# EAGLE design IO V1.1 (EAGLE 9.6.2)

## Sheet 1 of 6: BUS
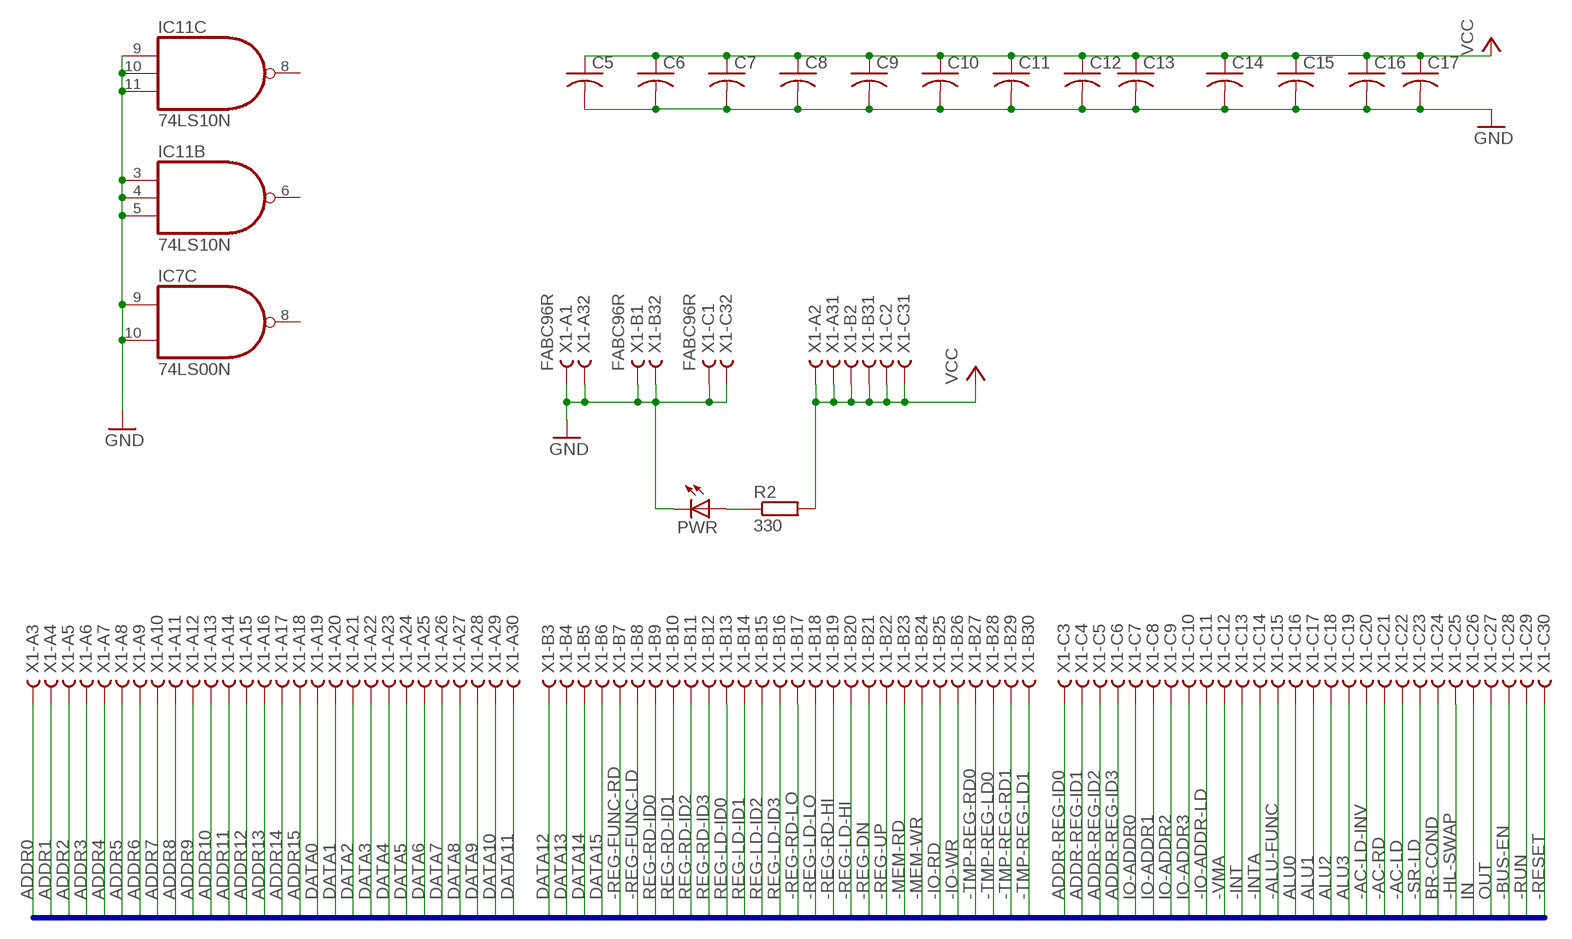
[diagram p0: schematic, sheet 1]

### Parts
C5  C-US025-024X044  [C025-024X044]
C6  C-US025-024X044  [C025-024X044]
C7  C-US025-024X044  [C025-024X044]
C8  C-US025-024X044  [C025-024X044]
C9  C-US025-024X044  [C025-024X044]
C10  C-US025-024X044  [C025-024X044]
C11  C-US025-024X044  [C025-024X044]
C12  C-US025-024X044  [C025-024X044]
C13  C-US025-024X044  [C025-024X044]
C14  C-US025-024X044  [C025-024X044]
C15  C-US025-024X044  [C025-024X044]
C16  C-US025-024X044  [C025-024X044]
C17  C-US025-024X044  [C025-024X044]
IC7  74LS00N  [DIL14]
IC11  74LS10N  [DIL14]
PWR  LED5MM  [LED5MM]
R2  330  R0207/10  [0207/10]
X1  FABC96R  [FABC96R]

### Nets
-AC-LD: X1.C22
-AC-LD-INV: X1.C20
-AC-RD: X1.C21
-ALU-FUNC: X1.C15
-BUS-EN: X1.C28
-HL-SWAP: X1.C25
-INT: X1.C13 ; also sheet 2
-INTA: X1.C14
-IO-ADDR-LD: X1.C11
-IO-RD: X1.B25 ; also sheet 6
-IO-WR: X1.B26 ; also sheet 6
-MEM-RD: X1.B23
-MEM-WR: X1.B24
-REG-DN: X1.B21
-REG-FUNC-LD: X1.B8
-REG-FUNC-RD: X1.B7
-REG-LD-HI: X1.B20
-REG-LD-LO: X1.B18
-REG-RD-HI: X1.B19
-REG-RD-LO: X1.B17
-REG-UP: X1.B22
-RESET: X1.C30 ; also sheet 6
-RUN: X1.C29
-SR-LD: X1.C23
-TMP-REG-LD0: X1.B28
-TMP-REG-LD1: X1.B30
-TMP-REG-RD0: X1.B27
-TMP-REG-RD1: X1.B29
-VMA: X1.C12
ADDR0: X1.A3
ADDR1: X1.A4
ADDR2: X1.A5
ADDR3: X1.A6
ADDR4: X1.A7
ADDR5: X1.A8
ADDR6: X1.A9
ADDR7: X1.A10
ADDR8: X1.A11
ADDR9: X1.A12
ADDR10: X1.A13
ADDR11: X1.A14
ADDR12: X1.A15
ADDR13: X1.A16
ADDR14: X1.A17
ADDR15: X1.A18
ADDR-REG-ID0: X1.C3
ADDR-REG-ID1: X1.C4
ADDR-REG-ID2: X1.C5
ADDR-REG-ID3: X1.C6
ALU0: X1.C16
ALU1: X1.C17
ALU2: X1.C18
ALU3: X1.C19
BR-COND: X1.C24
DATA0: X1.A19 ; also sheet 2,3,4,5
DATA1: X1.A20 ; also sheet 2,3,4,5
DATA2: X1.A21 ; also sheet 2,3,4,5
DATA3: X1.A22 ; also sheet 2,3,4,5
DATA4: X1.A23 ; also sheet 2,3,4,5
DATA5: X1.A24 ; also sheet 2,3,4,5
DATA6: X1.A25 ; also sheet 2,3,4,5
DATA7: X1.A26 ; also sheet 2,3,4,5
DATA8: X1.A27
DATA9: X1.A28
DATA10: X1.A29
DATA11: X1.A30
DATA12: X1.B3
DATA13: X1.B4
DATA14: X1.B5
DATA15: X1.B6
GND: C5.2 C6.2 C7.2 C8.2 C9.2 C10.2 C11.2 C12.2 C13.2 C14.2 C15.2 C16.2 C17.2 IC7.9(C:I0) IC7.10(C:I1) IC11.3(B:I0) IC11.4(B:I1) IC11.5(B:I2) IC11.9(C:I0) IC11.10(C:I1) IC11.11(C:I2) PWR.K(C) X1.A1 X1.A32 X1.B1 X1.B32 X1.C1 X1.C32 ; also sheet 2,3,4,5
IN: X1.C26 ; also sheet 4
IO-ADDR0: X1.C7 ; also sheet 5
IO-ADDR1: X1.C8 ; also sheet 5
IO-ADDR2: X1.C9 ; also sheet 5
IO-ADDR3: X1.C10 ; also sheet 5
N$11: PWR.A R2.1
OUT: X1.C27 ; also sheet 3
REG-LD-ID0: X1.B13
REG-LD-ID1: X1.B14
REG-LD-ID2: X1.B15
REG-LD-ID3: X1.B16
REG-RD-ID0: X1.B9
REG-RD-ID1: X1.B10
REG-RD-ID2: X1.B11
REG-RD-ID3: X1.B12
VCC: C5.1 C6.1 C7.1 C8.1 C9.1 C10.1 C11.1 C12.1 C13.1 C14.1 C15.1 C16.1 C17.1 R2.2 X1.A2 X1.A31 X1.B2 X1.B31 X1.C2 X1.C31 ; also sheet 2,3,4,5,6
Unconnected: IC7.8(C:O) IC11.6(B:O) IC11.8(C:O)

### Buses
-AC-LD,-AC-LD-INV,-AC-RD,ADDR[0..15],ADDR-REG-ID0,ADDR-REG-ID1,ADDR-REG-ID2,ADDR-REG-ID3,ALU[0..3],-ALU-FUNC,BR-COND,-BUS-EN,DATA[0..15],-HL-SWAP,IN,-INT,-INTA,IO-ADDR[0..3],-IO-ADDR-LD,-IO-RD,-IO-WR,-MEM-RD,-MEM-WR,OUT,-REG-DN,-REG-FUNC-LD,-REG-FUNC-RD,-REG-LD-HI,REG-LD-ID[0..3],-REG-LD-LO,-REG-RD-HI,REG-RD-ID[0..3],-REG-RD-LO,-REG-UP,-RESET,-RUN,-SR-LD,-TMP-REG-LD[0..1],-TMP-REG-RD[0..1],-VMA

## Sheet 2 of 6: Serial Interface
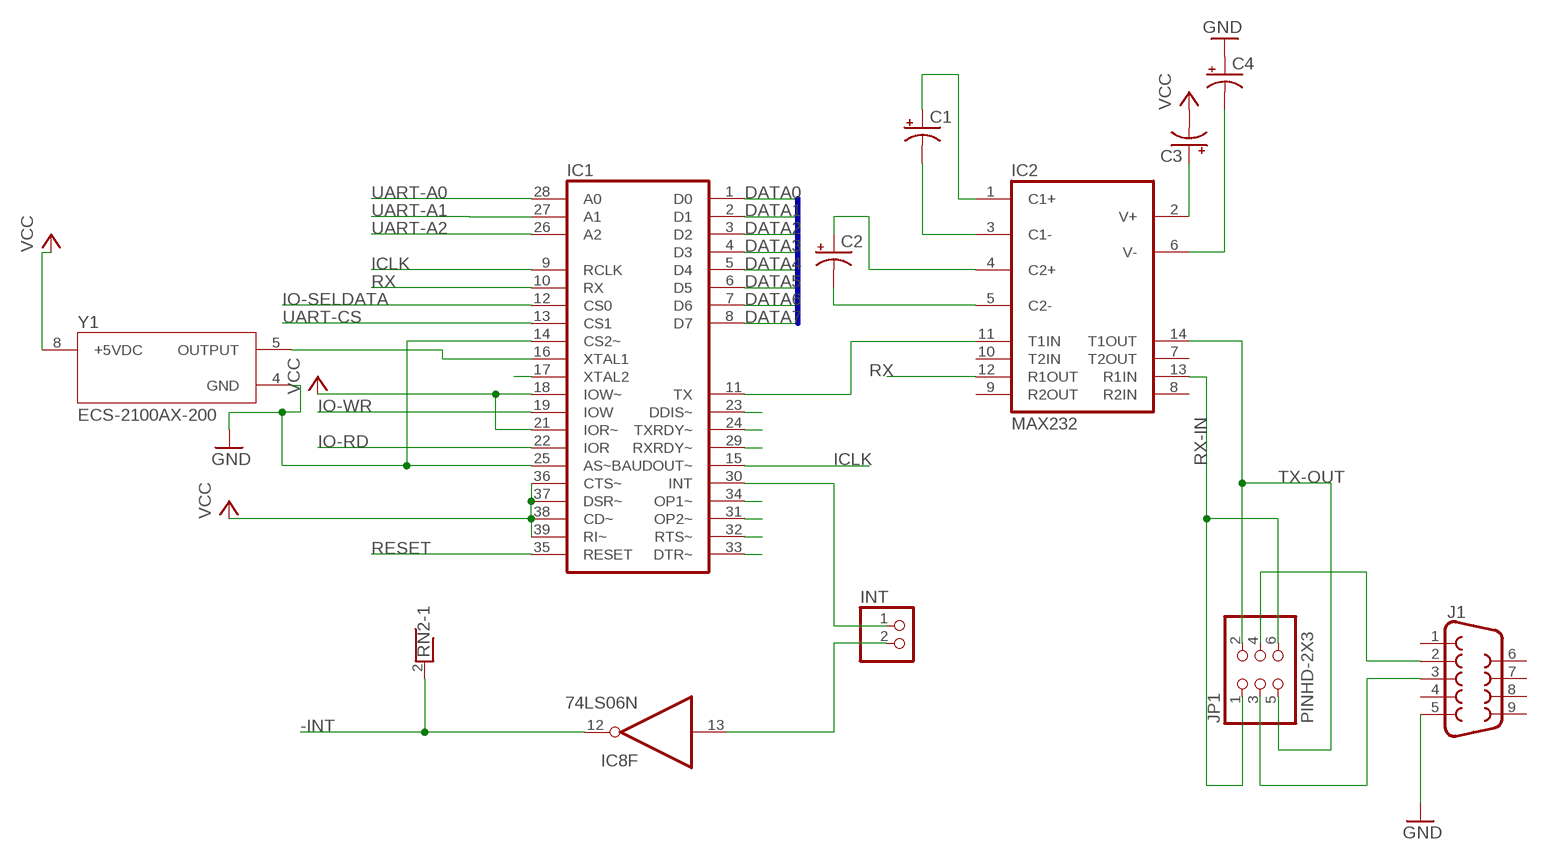
[diagram p1: schematic, sheet 2]

### Parts
C1  CPOL-USE2,5-6E  [E2,5-6E]
C2  CPOL-USE2,5-6E  [E2,5-6E]
C3  CPOL-USE2,5-6E  [E2,5-6E]
C4  CPOL-USE2,5-6E  [E2,5-6E]
IC1  XR-16C550P  [DIL40]
IC2  MAX232  [DIL16]
IC8  74LS06N  [DIL14]
INT  PINHD-1X2  [1X02]
J1  DB9FEMALE  [DB9]
JP1  PINHD-2X3  [2X03]
RN2  RNX6  [RN-7]
Y1  ECS-2100AX-200  [ECS-2100AX-200]

### Nets
-INT: IC8.12(F:O) RN2.2 ; also sheet 1
DATA0: IC1.1(D0) ; also sheet 1,3,4,5
DATA1: IC1.2(D1) ; also sheet 1,3,4,5
DATA2: IC1.3(D2) ; also sheet 1,3,4,5
DATA3: IC1.4(D3) ; also sheet 1,3,4,5
DATA4: IC1.5(D4) ; also sheet 1,3,4,5
DATA5: IC1.6(D5) ; also sheet 1,3,4,5
DATA6: IC1.7(D6) ; also sheet 1,3,4,5
DATA7: IC1.8(D7) ; also sheet 1,3,4,5
GND: C4.+ IC1.14(CS2~) IC1.25(AS~) J1.5 Y1.4(GND) ; also sheet 1,3,4,5
ICLK: IC1.9(RCLK) IC1.15(BAUDOUT~)
IO-RD: IC1.22(IOR) ; also sheet 4,6
IO-SELDATA: IC1.12(CS0) ; also sheet 3,4,5
IO-WR: IC1.19(IOW) ; also sheet 3,5,6
N$31: IC1.16(XTAL1) Y1.5(OUTPUT)
N$35: J1.2 JP1.4
N$36: J1.3 JP1.3
N$37: IC1.11(TX) IC2.11(T1IN)
N$51: C2.- IC2.5(C2-)
N$52: C2.+ IC2.4(C2+)
N$53: IC1.31(OP2~)
N$54: IC1.32(RTS~)
N$55: IC1.33(DTR~)
N$56: IC1.34(OP1~)
N$57: IC1.30(INT) INT.1
N$58: IC1.23(DDIS~)
N$59: IC1.24(TXRDY~)
N$60: IC1.29(RXRDY~)
N$61: IC1.17(XTAL2)
N$62: C1.- IC2.3(C1-)
N$63: C1.+ IC2.1(C1+)
N$64: C3.+ IC2.2(V+)
N$65: C4.- IC2.6(V-)
N$66: IC8.13(F:I) INT.2
RESET: IC1.35(RESET) ; also sheet 6
RX: IC1.10(RX) IC2.12(R1OUT)
RX-IN: IC2.13(R1IN) JP1.1 JP1.6
TX-OUT: IC2.14(T1OUT) JP1.2 JP1.5
UART-A0: IC1.28(A0) ; also sheet 5
UART-A1: IC1.27(A1) ; also sheet 5
UART-A2: IC1.26(A2) ; also sheet 5
UART-CS: IC1.13(CS1) ; also sheet 5
VCC: C3.- IC1.18(IOW~) IC1.21(IOR~) IC1.36(CTS~) IC1.37(DSR~) IC1.38(CD~) IC1.39(RI~) Y1.8(+5VDC) ; also sheet 1,3,4,5,6
Unconnected: IC2.7(T2OUT) IC2.8(R2IN) IC2.9(R2OUT) IC2.10(T2IN) J1.1 J1.4 J1.6 J1.7 J1.8 J1.9

### Buses
DATABUS:DATA[0..15]

## Sheet 3 of 6: Output
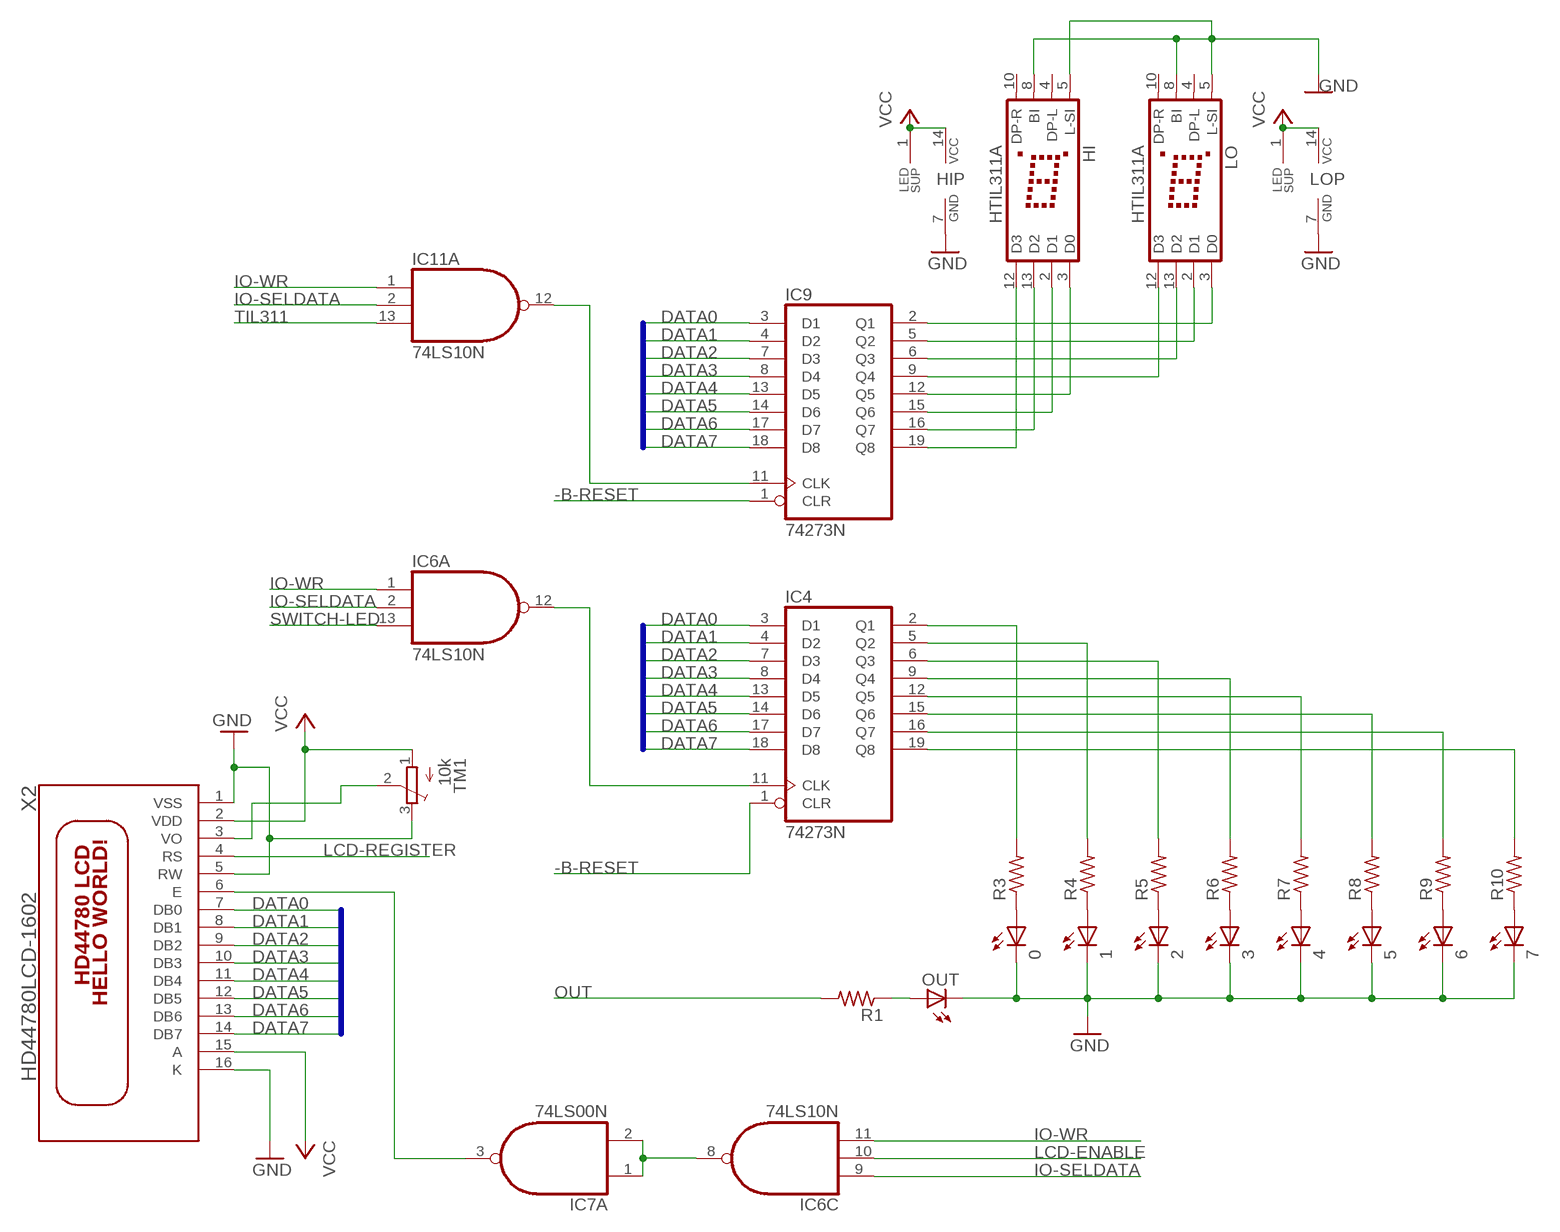
[diagram p2: schematic, sheet 3]

### Parts
0  LED5MM  [LED5MM]
1  LED5MM  [LED5MM]
2  LED5MM  [LED5MM]
3  LED5MM  [LED5MM]
4  LED5MM  [LED5MM]
5  LED5MM  [LED5MM]
6  LED5MM  [LED5MM]
7  LED5MM  [LED5MM]
HI  HTIL311A  [HTIL311A]
IC4  74273N  [DIL20]
IC6  74LS10N  [DIL14]
IC9  74273N  [DIL20]
LO  HTIL311A  [HTIL311A]
OUT  LED5MM  [LED5MM]
R1  R-US_0207/10  [0207/10]
R3  R-US_0207/10  [0207/10]
R4  R-US_0207/10  [0207/10]
R5  R-US_0207/10  [0207/10]
R6  R-US_0207/10  [0207/10]
R7  R-US_0207/10  [0207/10]
R8  R-US_0207/10  [0207/10]
R9  R-US_0207/10  [0207/10]
R10  R-US_0207/10  [0207/10]
TM1  10k  TRIMPOT3386  [TRIM-3386]
X2  HD44780LCD-1602  [LCD1602]

### Nets
-B-RESET: IC4.1(CLR) IC9.1(CLR) ; also sheet 5,6
DATA0: IC4.3(D1) IC9.3(D1) X2.7(DB0) ; also sheet 1,2,4,5
DATA1: IC4.4(D2) IC9.4(D2) X2.8(DB1) ; also sheet 1,2,4,5
DATA2: IC4.7(D3) IC9.7(D3) X2.9(DB2) ; also sheet 1,2,4,5
DATA3: IC4.8(D4) IC9.8(D4) X2.10(DB3) ; also sheet 1,2,4,5
DATA4: IC4.13(D5) IC9.13(D5) X2.11(DB4) ; also sheet 1,2,4,5
DATA5: IC4.14(D6) IC9.14(D6) X2.12(DB5) ; also sheet 1,2,4,5
DATA6: IC4.17(D7) IC9.17(D7) X2.13(DB6) ; also sheet 1,2,4,5
DATA7: IC4.18(D8) IC9.18(D8) X2.14(DB7) ; also sheet 1,2,4,5
GND: 0.K(C) 1.K(C) 2.K(C) 3.K(C) 4.K(C) 5.K(C) 6.K(C) 7.K(C) HI.5(L-SI) HI.7(GND) HI.8(BI) LO.5(L-SI) LO.7(GND) LO.8(BI) OUT.K(C) TM1.3(E) X2.1(VSS) X2.5(RW) X2.16(K) ; also sheet 1,2,4,5
IO-SELDATA: IC6.2(A:I1) IC6.9(C:I0) IC11.2(A:I1) ; also sheet 2,4,5
IO-WR: IC6.1(A:I0) IC6.11(C:I2) IC11.1(A:I0) ; also sheet 2,5,6
LCD-ENABLE: IC6.10(C:I1) ; also sheet 5
LCD-REGISTER: X2.4(RS) ; also sheet 5
N$9: OUT.A R1.1
N$10: 2.A R5.1
N$12: 3.A R6.1
N$13: 4.A R7.1
N$14: 0.A R3.1
N$15: 1.A R4.1
N$16: 5.A R8.1
N$17: 7.A R10.1
N$18: 6.A R9.1
N$19: IC4.19(Q8) R10.2
N$20: IC4.16(Q7) R9.2
N$21: IC4.15(Q6) R8.2
N$22: IC4.12(Q5) R7.2
N$23: IC4.9(Q4) R6.2
N$24: IC4.6(Q3) R5.2
N$25: IC4.5(Q2) R4.2
N$26: IC4.2(Q1) R3.2
N$28: HI.12(D3) IC9.19(Q8)
N$30: IC7.3(A:O) X2.6(E)
N$33: IC6.8(C:O) IC7.1(A:I0) IC7.2(A:I1)
N$41: IC4.11(CLK) IC6.12(A:O)
N$44: TM1.2(S) X2.3(VO)
N$68: HI.13(D2) IC9.16(Q7)
N$69: HI.2(D1) IC9.15(Q6)
N$70: HI.3(D0) IC9.12(Q5)
N$71: IC9.9(Q4) LO.12(D3)
N$72: IC9.6(Q3) LO.13(D2)
N$73: IC9.5(Q2) LO.2(D1)
N$74: IC9.2(Q1) LO.3(D0)
N$75: IC9.11(CLK) IC11.12(A:O)
OUT: R1.2 ; also sheet 1
SWITCH-LED: IC6.13(A:I2) ; also sheet 4,5
TIL311: IC11.13(A:I2) ; also sheet 5
VCC: HI.1(LEDSUP) HI.14(VCC) LO.1(LEDSUP) LO.14(VCC) TM1.1(A) X2.2(VDD) X2.15(A) ; also sheet 1,2,4,5,6
Unconnected: HI.4(DP-L) HI.10(DP-R) LO.4(DP-L) LO.10(DP-R)

### Buses
DATABUS:DATA[0..15]

## Sheet 4 of 6: Input
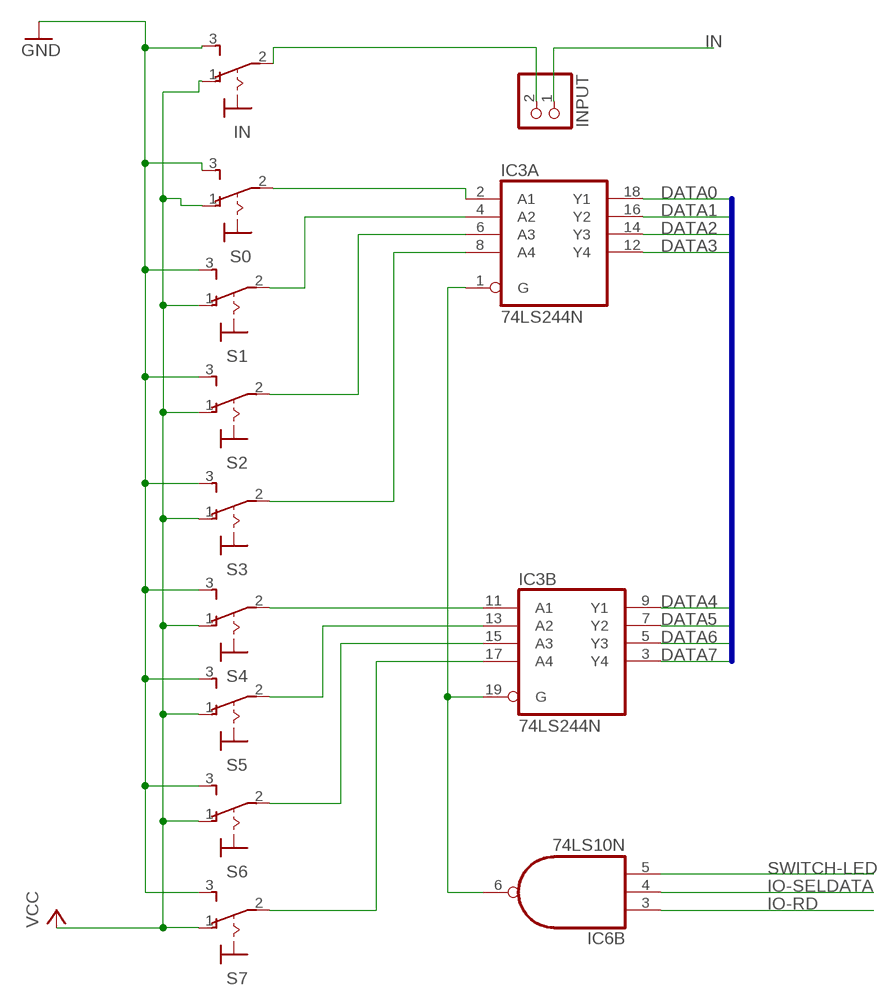
[diagram p3: schematic, sheet 4]

### Parts
IC3  74LS244N  [DIL20]
IN  M9040P  [M9040P]
INPUT  PINHD-1X2  [1X02]
S0  M9040P  [M9040P]
S1  M9040P  [M9040P]
S2  M9040P  [M9040P]
S3  M9040P  [M9040P]
S4  M9040P  [M9040P]
S5  M9040P  [M9040P]
S6  M9040P  [M9040P]
S7  M9040P  [M9040P]

### Nets
DATA0: IC3.18(A:Y1) ; also sheet 1,2,3,5
DATA1: IC3.16(A:Y2) ; also sheet 1,2,3,5
DATA2: IC3.14(A:Y3) ; also sheet 1,2,3,5
DATA3: IC3.12(A:Y4) ; also sheet 1,2,3,5
DATA4: IC3.9(B:Y1) ; also sheet 1,2,3,5
DATA5: IC3.7(B:Y2) ; also sheet 1,2,3,5
DATA6: IC3.5(B:Y3) ; also sheet 1,2,3,5
DATA7: IC3.3(B:Y4) ; also sheet 1,2,3,5
GND: IN.3(S) S0.3(S) S1.3(S) S2.3(S) S3.3(S) S4.3(S) S5.3(S) S6.3(S) S7.3(S) ; also sheet 1,2,3,5
IN: INPUT.1 ; also sheet 1
IO-RD: IC6.3(B:I0) ; also sheet 2,6
IO-SELDATA: IC6.4(B:I1) ; also sheet 2,3,5
N$1: IC3.2(A:A1) S0.2(P)
N$2: IC3.4(A:A2) S1.2(P)
N$3: IC3.6(A:A3) S2.2(P)
N$4: IC3.8(A:A4) S3.2(P)
N$5: IC3.11(B:A1) S4.2(P)
N$6: IC3.13(B:A2) S5.2(P)
N$7: IC3.15(B:A3) S6.2(P)
N$8: IC3.17(B:A4) S7.2(P)
N$32: IC3.1(A:G) IC3.19(B:G) IC6.6(B:O)
N$34: IN.2(P) INPUT.2
SWITCH-LED: IC6.5(B:I2) ; also sheet 3,5
VCC: IN.1(O) S0.1(O) S1.1(O) S2.1(O) S3.1(O) S4.1(O) S5.1(O) S6.1(O) S7.1(O) ; also sheet 1,2,3,5,6

### Buses
DATABUS:DATA[0..15]

## Sheet 5 of 6: Board Select logic
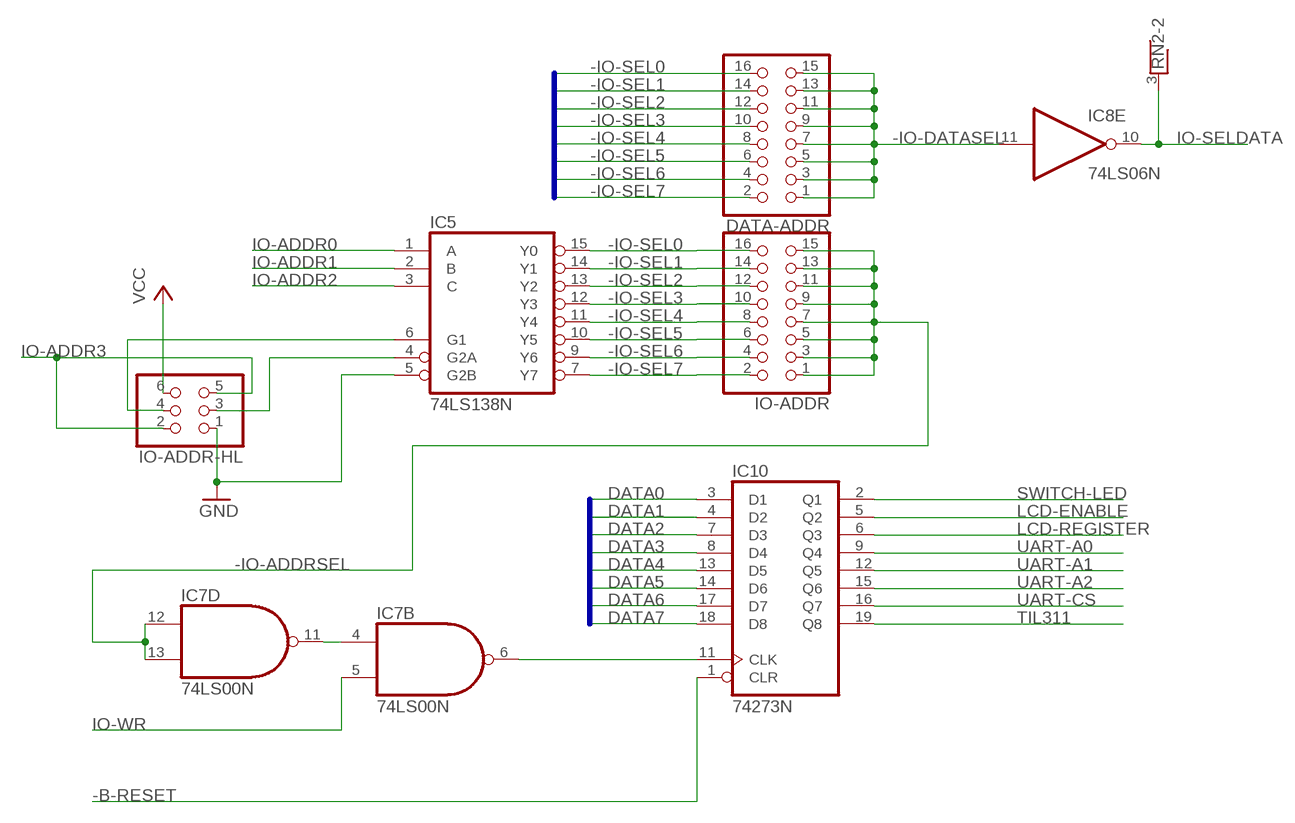
[diagram p4: schematic, sheet 5]

### Parts
DATA-ADDR  PINHD-2X8  [2X08]
IC5  74LS138N  [DIL16]
IC10  74273N  [DIL20]
IO-ADDR  PINHD-2X8  [2X08]
IO-ADDR-HL  PINHD-2X3  [2X03]

### Nets
-B-RESET: IC10.1(CLR) ; also sheet 3,6
-IO-ADDRSEL: IC7.12(D:I0) IC7.13(D:I1) IO-ADDR.1 IO-ADDR.3 IO-ADDR.5 IO-ADDR.7 IO-ADDR.9 IO-ADDR.11 IO-ADDR.13 IO-ADDR.15
-IO-DATASEL: DATA-ADDR.1 DATA-ADDR.3 DATA-ADDR.5 DATA-ADDR.7 DATA-ADDR.9 DATA-ADDR.11 DATA-ADDR.13 DATA-ADDR.15 IC8.11(E:I)
-IO-SEL0: DATA-ADDR.16 IC5.15(Y0) IO-ADDR.16
-IO-SEL1: DATA-ADDR.14 IC5.14(Y1) IO-ADDR.14
-IO-SEL2: DATA-ADDR.12 IC5.13(Y2) IO-ADDR.12
-IO-SEL3: DATA-ADDR.10 IC5.12(Y3) IO-ADDR.10
-IO-SEL4: DATA-ADDR.8 IC5.11(Y4) IO-ADDR.8
-IO-SEL5: DATA-ADDR.6 IC5.10(Y5) IO-ADDR.6
-IO-SEL6: DATA-ADDR.4 IC5.9(Y6) IO-ADDR.4
-IO-SEL7: DATA-ADDR.2 IC5.7(Y7) IO-ADDR.2
DATA0: IC10.3(D1) ; also sheet 1,2,3,4
DATA1: IC10.4(D2) ; also sheet 1,2,3,4
DATA2: IC10.7(D3) ; also sheet 1,2,3,4
DATA3: IC10.8(D4) ; also sheet 1,2,3,4
DATA4: IC10.13(D5) ; also sheet 1,2,3,4
DATA5: IC10.14(D6) ; also sheet 1,2,3,4
DATA6: IC10.17(D7) ; also sheet 1,2,3,4
DATA7: IC10.18(D8) ; also sheet 1,2,3,4
GND: IC5.5(G2B) IO-ADDR-HL.1 ; also sheet 1,2,3,4
IO-ADDR0: IC5.1(A) ; also sheet 1
IO-ADDR1: IC5.2(B) ; also sheet 1
IO-ADDR2: IC5.3(C) ; also sheet 1
IO-ADDR3: IO-ADDR-HL.2 IO-ADDR-HL.5 ; also sheet 1
IO-SELDATA: IC8.10(E:O) RN2.3 ; also sheet 2,3,4
IO-WR: IC7.5(B:I1) ; also sheet 2,3,6
LCD-ENABLE: IC10.5(Q2) ; also sheet 3
LCD-REGISTER: IC10.6(Q3) ; also sheet 3
N$27: IC5.4(G2A) IO-ADDR-HL.3
N$29: IC5.6(G1) IO-ADDR-HL.4
N$40: IC7.6(B:O) IC10.11(CLK)
N$67: IC7.4(B:I0) IC7.11(D:O)
SWITCH-LED: IC10.2(Q1) ; also sheet 3,4
TIL311: IC10.19(Q8) ; also sheet 3
UART-A0: IC10.9(Q4) ; also sheet 2
UART-A1: IC10.12(Q5) ; also sheet 2
UART-A2: IC10.15(Q6) ; also sheet 2
UART-CS: IC10.16(Q7) ; also sheet 2
VCC: IO-ADDR-HL.6 ; also sheet 1,2,3,4,6

### Buses
DATABUS:DATA[0..15]
-IO-ADDRSEL,-IO-SEL0,-IO-SEL1,-IO-SEL2,-IO-SEL3,-IO-SEL4,-IO-SEL5,-IO-SEL6,-IO-SEL7

## Sheet 6 of 6: Bus Buffering
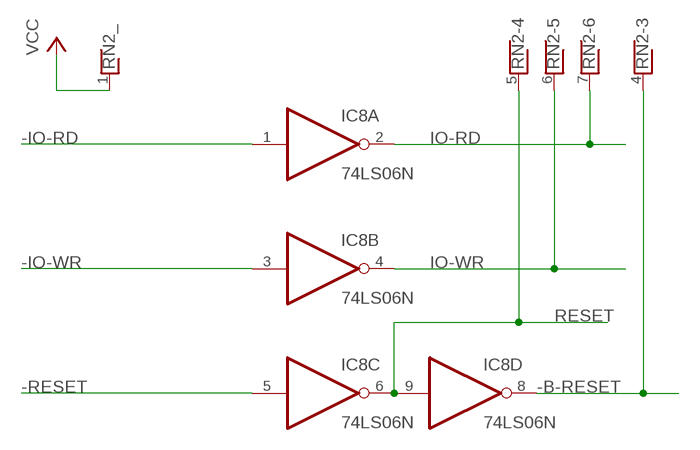
[diagram p5: schematic, sheet 6]

### Nets
-B-RESET: IC8.8(D:O) RN2.4 ; also sheet 3,5
-IO-RD: IC8.1(A:I) ; also sheet 1
-IO-WR: IC8.3(B:I) ; also sheet 1
-RESET: IC8.5(C:I) ; also sheet 1
IO-RD: IC8.2(A:O) RN2.7 ; also sheet 2,4
IO-WR: IC8.4(B:O) RN2.6 ; also sheet 2,3,5
RESET: IC8.6(C:O) IC8.9(D:I) RN2.5 ; also sheet 2
VCC: RN2.1 ; also sheet 1,2,3,4,5

## Power pins joined to a net without a drawn wire
GND: IC1.20(GND) IC2.15(GND) IC3.10(P:GND) IC4.10(GND) IC5.8(GND) IC6.7(P:GND) IC7.7(P:GND) IC8.7(P:GND) IC9.10(GND) IC10.10(GND) IC11.7(P:GND)
VCC: IC1.40(VCC) IC2.16(VCC) IC3.20(P:VCC) IC4.20(VCC) IC5.16(VCC) IC6.14(P:VCC) IC7.14(P:VCC) IC8.14(P:VCC) IC9.20(VCC) IC10.20(VCC) IC11.14(P:VCC)

## Library data of the parts
0 1-7 OUT = adafruit:LED: LED
C1-C4 = rcl:CPOL-US: POLARIZED CAPACITOR, American symbol; SPICEPREFIX: C
C5-C17 = adafruit:C-US: CAPACITOR, American symbol
DATA-ADDR IO-ADDR = pinhead:PINHD-2X8: PIN HEADER
HI LO = display-hp:HTIL311A: LED DISPLAY 1-character dot matrix, 2 decimal points Internal TTL MSI IC with Latch, Decoder, and Driver Source: http://www.taosinc.com .. til311-e6.pdf; OC_FARNELL: unknown; OC_NEWARK: unknown
IC1 = exar:XR-16C550P: UART/FIFO; MPN: ST16C450CP40; OC_FARNELL: 1294801; OC_NEWARK: 24R1445
IC2 = maxim:MAX232: RS232 TRANSCEIVER; MF: MAXIM; MPN: MAX232ACPE+; OC_FARNELL: 9723773; OC_NEWARK: 68K4544
IC3 = 74xx-us:74*244: Octal BUFFER and LINE DRIVER, 3-state
IC4 IC9 IC10 = 74xx-us:74*273: Octal D type FLIP FLOP, clear
IC5 = 74xx-us:74*138: 3-line to 8-line DECODER/DEMULTIPLEXER
IC6 IC11 = 74xx-us:74*10: Triple 3-input NAND gate
IC7 = 74xx-us:74*00: Quad 2-input NAND gate
IC8 = 74xx-us:74*06: Hex INVERTER, open collector high-voltage output
IN S0 S1-S7 = switch:M9040P: TOGGLE SWITCH Marquardt
INPUT INT = pinhead:PINHD-1X2: PIN HEADER
IO-ADDR-HL = pinhead:PINHD-2X3: PIN HEADER
J1 = SparkFun-Connectors:DB9: DB9 Connector Standard DB9 (D-Sub 9) serial connector. Can be used for CAN bus as well as RS485 and RS232. Footprint production proven. Here is the female version connector we sell at SparkFun: 9 Pin Female Serial Connector - PCB Mount <https://www.sparkfun.com/products/429> (PRT-00429) This connector has been used on the following SparkFun products: SparkFun RS232 Shifter - SMD <https://www.sparkfun.com/products/449> (PRT-00449) SparkFun RS232 Shifter SMD (No DB9) <https://www.sparkfun.com/products/8780> (PRT-08780); PROD_ID: CONN-08194
JP1 = Connector:PINHD-2X3: PIN HEADER; CATEGORY: CONNECTOR; SUB-CATEGORY: PIN-HEADER
PWR = led:LED: LED
R1 R3-R10 = rcl:R-US_: RESISTOR, American symbol; SPICEPREFIX: R
R2 = eagle-ltspice:R: RESISTOR, European symbol; SPICEMODEL: NONE; SPICEPREFIX: R
RN2 = resistor-net:RNX6: RESISTOR NETWORK; OC_FARNELL: unknown; OC_NEWARK: unknown
TM1 = adafruit:TRIMPOT: SMT trimmer potentiometer part number TC33X http://www.ladyada.net/library/eagle
X1 = con-vg:FABC96R: CONNECTOR female, 96 pins, type R, rows ABC, grid 2.54 mm
X2 = adafruit:HD44780LCD: HD44780 LCD Standard character type LCDs, available in sizes from 8x1 to 40x4!
Y1 = Crystals_Oscillators:ECS-2100AX-200: XTAL OSC XO 20.0000MHZ HCMOS TTL Manufacturer's datasheet <https://ecsxtal.com/store/pdf/ecs-2100x.pdf>; CREATED_BY: PCBLayout.com; DIGIKEY_PART_NUMBER: X964-ND; MANUFACTURER: ECS Inc.; MPN: ECS-2100AX-200; PACKAGE: 8-DIP

## Net classes
1 GND: width 1 mm
2 5V: width 1 mm

## Board
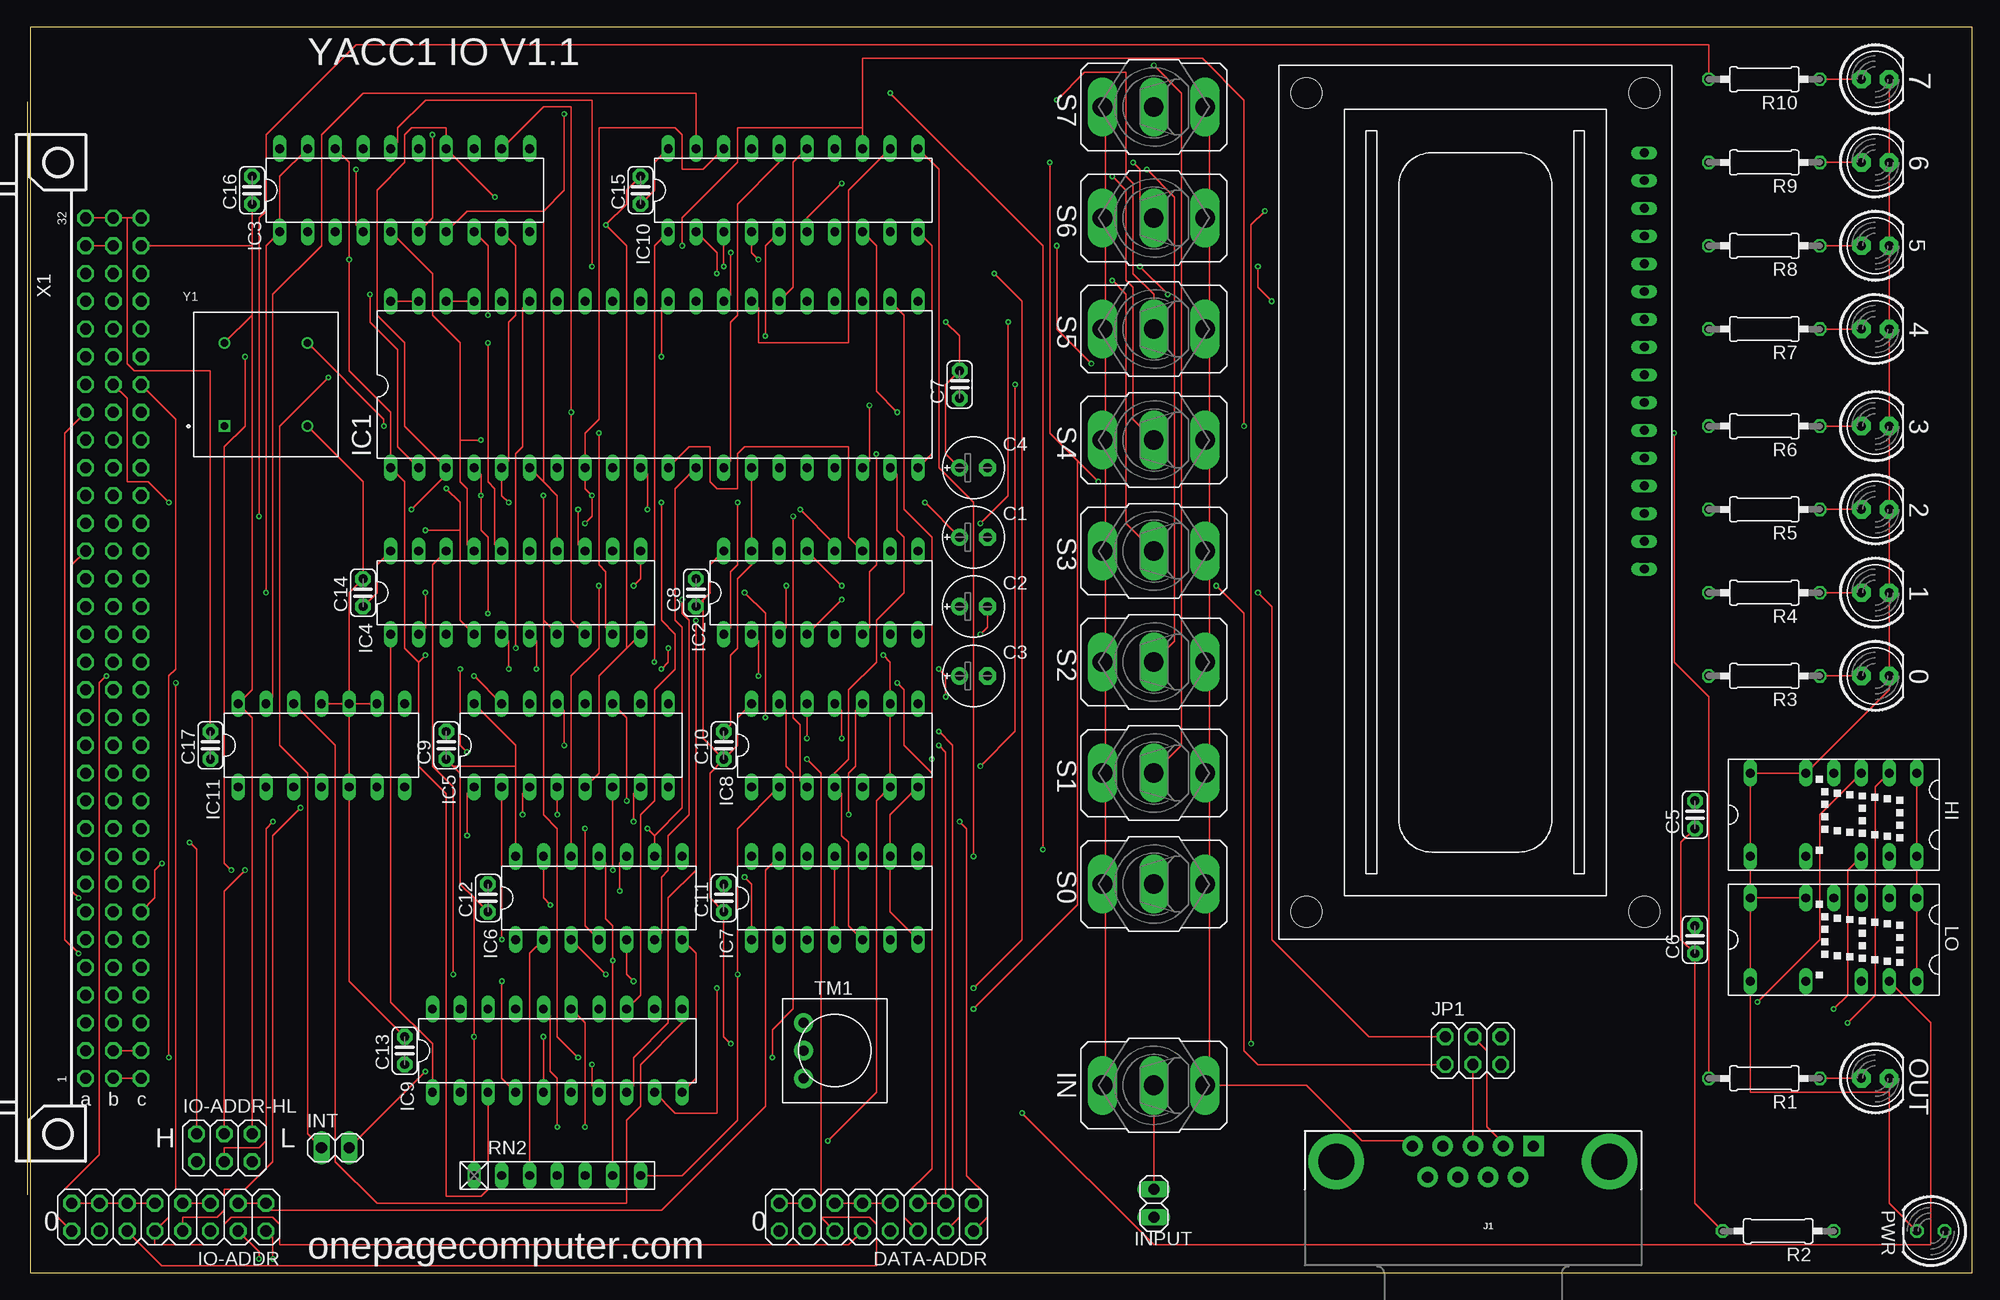
[diagram p6: board, top side]
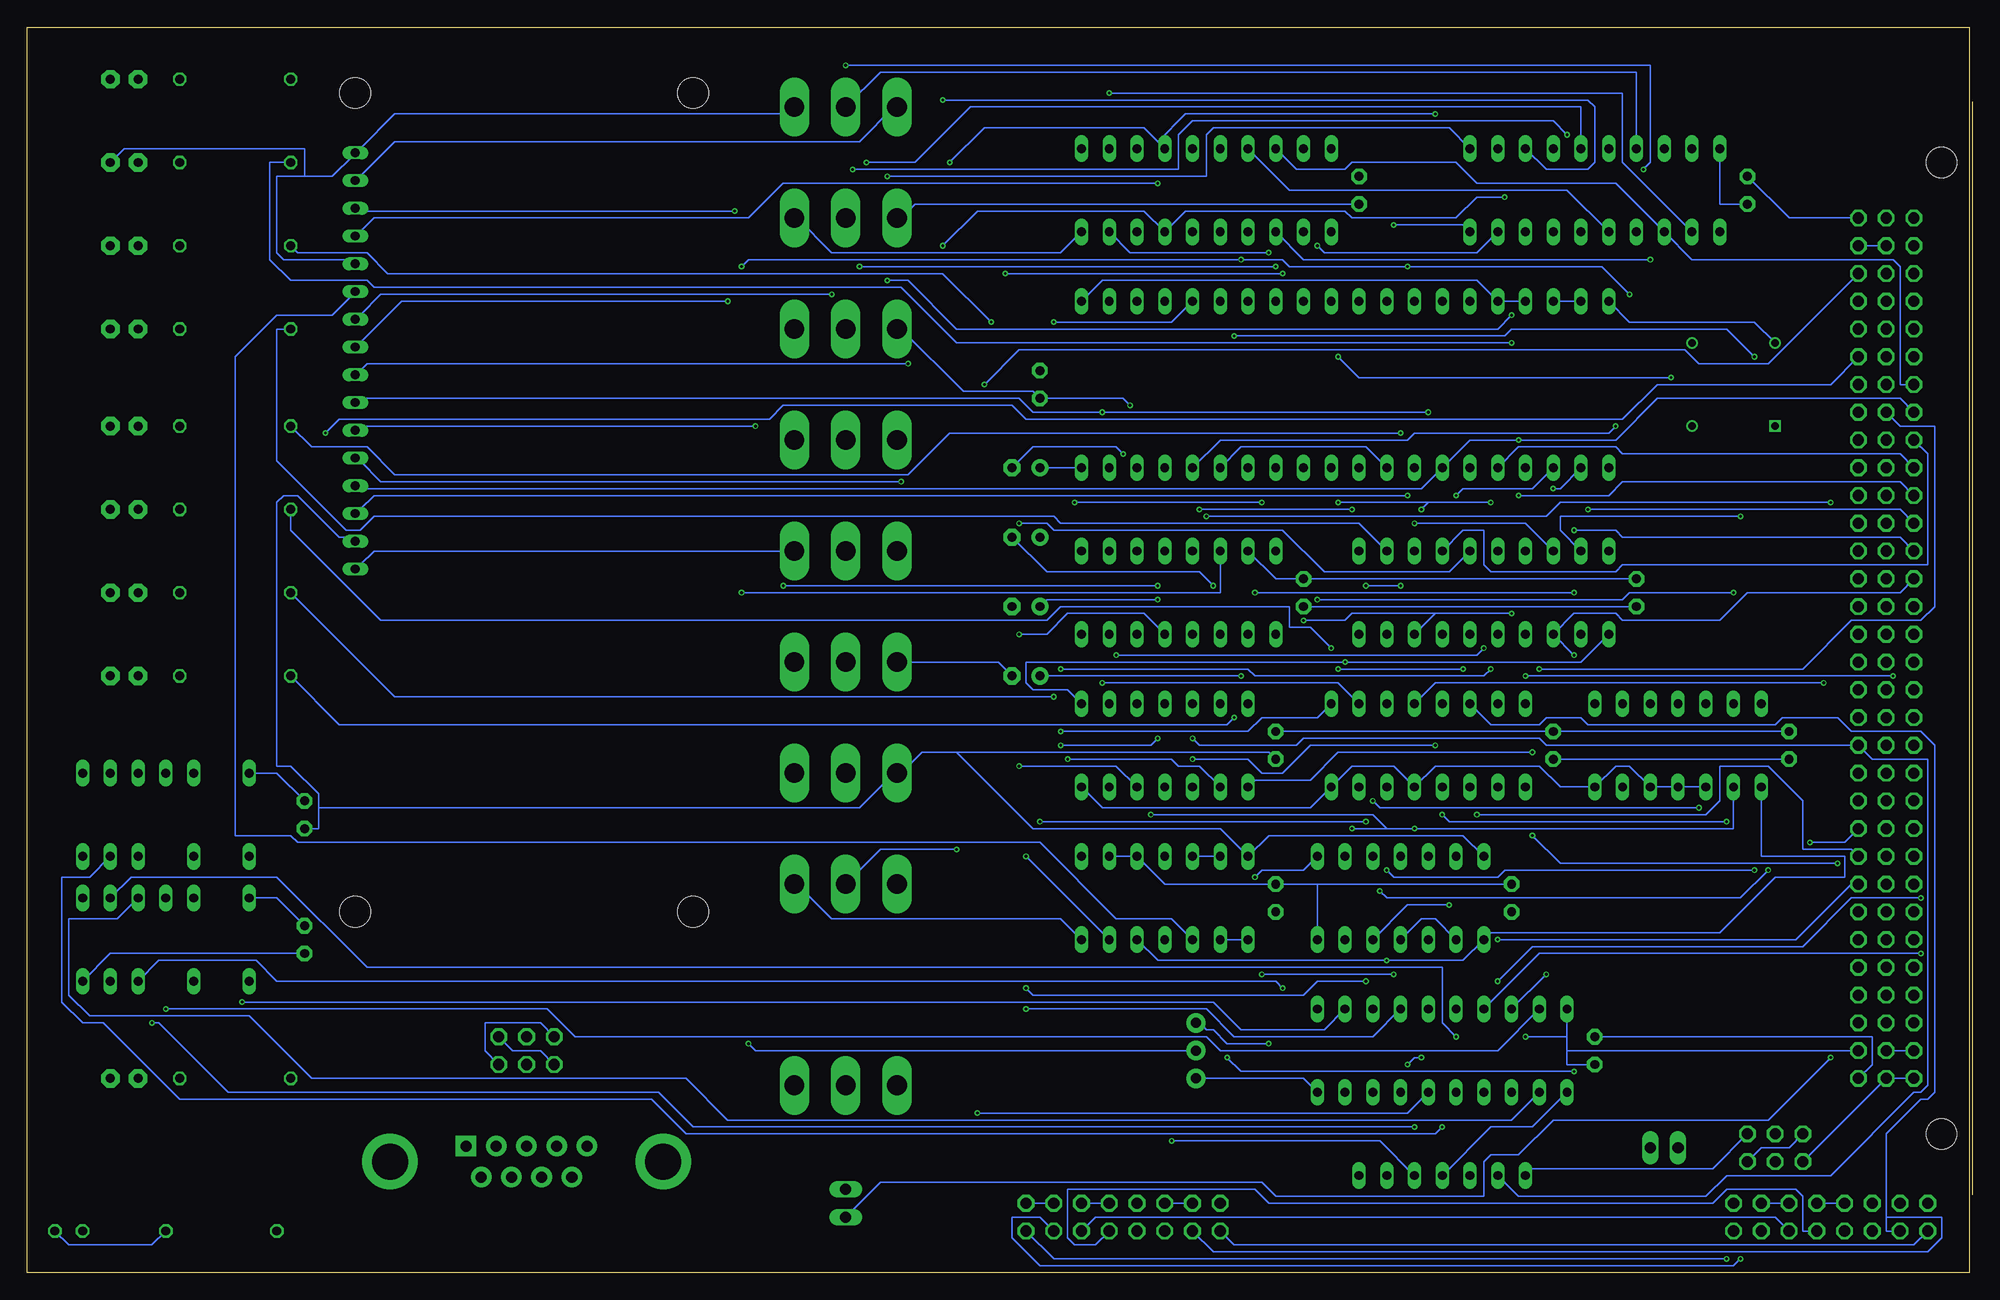
[diagram p7: board, bottom side, seen from below]

Size 177.78 x 113.97 mm. Coordinates in mm from the lower left corner, seen from the top.
Outline: 0,0 177.78,0 177.78,113.97 0,113.97 0,0
Copper layers (1*16): Top 0.035559375mm / dielectric 1.6mm / Bottom 0.035559375mm
Design rules "oshpark-2layer *": minimum track width 6mil, minimum drill 10mil, track to track 12mil, track to pad 10mil, pad to pad 6mil, via to via 6mil, smd to smd 6mil, copper to edge 15mil, drill to drill 6mil, minimum pad ring 5mil, minimum via ring 5mil, stop-mask expansion 2.5mil, vias tented up to drill 0mil, thermal gap 10mil
tRestrict: area 114.3,30.5 to 149.9,110.5

### Footprints (pad centres in the part's own frame; a part is rotated, then mirrored left to right if it is on the bottom)
LED5MM = drill 0.813 pad 1.676 octagon: A -1.27,0; K 1.27,0
E2,5-6E = drill 0.813 pad 1.575: + -1.27,0 | drill 0.813 pad 1.575 octagon: - 1.27,0
C025-024X044 = drill 0.813 pad 1.422 octagon: 1 -1.27,0; 2 1.27,0
2X08 = drill 1.016 octagon: 1 -8.89,-1.27; 2 -8.89,1.27; 3 -6.35,-1.27; 4 -6.35,1.27; 5 -3.81,-1.27; 6 -3.81,1.27; 7 -1.27,-1.27; 8 -1.27,1.27; 9 1.27,-1.27; 10 1.27,1.27; 11 3.81,-1.27; 12 3.81,1.27; 13 6.35,-1.27; 14 6.35,1.27; 15 8.89,-1.27; 16 8.89,1.27
HTIL311A = drill 0.813 long: 1 -3.81,7.62; 2 -3.81,5.08; 3 -3.81,2.54; 4 -3.81,0; 5 -3.81,-2.54; 7 -3.81,-7.62; 8 3.81,-7.62; 10 3.81,-2.54; 12 3.81,2.54; 13 3.81,5.08; 14 3.81,7.62
DIL40 = drill 0.813 long: 1 -24.13,-7.62; 2 -21.59,-7.62; 3 -19.05,-7.62; 4 -16.51,-7.62; 5 -13.97,-7.62; 6 -11.43,-7.62; 7 -8.89,-7.62; 8 -6.35,-7.62; 9 -3.81,-7.62; 10 -1.27,-7.62; 11 1.27,-7.62; 12 3.81,-7.62; 13 6.35,-7.62; 14 8.89,-7.62; 15 11.43,-7.62; 16 13.97,-7.62; 17 16.51,-7.62; 18 19.05,-7.62; 19 21.59,-7.62; 20 24.13,-7.62; 21 24.13,7.62; 22 21.59,7.62; 23 19.05,7.62; 24 16.51,7.62; 25 13.97,7.62; 26 11.43,7.62; 27 8.89,7.62; 28 6.35,7.62; 29 3.81,7.62; 30 1.27,7.62; 31 -1.27,7.62; 32 -3.81,7.62; 33 -6.35,7.62; 34 -8.89,7.62; 35 -11.43,7.62; 36 -13.97,7.62; 37 -16.51,7.62; 38 -19.05,7.62; 39 -21.59,7.62; 40 -24.13,7.62
DIL16 = drill 0.813 long: 1 -8.89,-3.81; 2 -6.35,-3.81; 3 -3.81,-3.81; 4 -1.27,-3.81; 5 1.27,-3.81; 6 3.81,-3.81; 7 6.35,-3.81; 8 8.89,-3.81; 9 8.89,3.81; 10 6.35,3.81; 11 3.81,3.81; 12 1.27,3.81; 13 -1.27,3.81; 14 -3.81,3.81; 15 -6.35,3.81; 16 -8.89,3.81
DIL20 = drill 0.813 long: 1 -11.43,-3.81; 2 -8.89,-3.81; 3 -6.35,-3.81; 4 -3.81,-3.81; 5 -1.27,-3.81; 6 1.27,-3.81; 7 3.81,-3.81; 8 6.35,-3.81; 9 8.89,-3.81; 10 11.43,-3.81; 11 11.43,3.81; 12 8.89,3.81; 13 6.35,3.81; 14 3.81,3.81; 15 1.27,3.81; 16 -1.27,3.81; 17 -3.81,3.81; 18 -6.35,3.81; 19 -8.89,3.81; 20 -11.43,3.81
DIL14 = drill 0.813 long: 1 -7.62,-3.81; 2 -5.08,-3.81; 3 -2.54,-3.81; 4 0,-3.81; 5 2.54,-3.81; 6 5.08,-3.81; 7 7.62,-3.81; 8 7.62,3.81; 9 5.08,3.81; 10 2.54,3.81; 11 0,3.81; 12 -2.54,3.81; 13 -5.08,3.81; 14 -7.62,3.81
M9040P = drill 1.803 long: 1 0,4.699; 2 0,0; 3 0,-4.699
1X02 = drill 1.016 long: 1 -1.27,0; 2 1.27,0
2X03 = drill 1.016 octagon: 1 -2.54,-1.27; 2 -2.54,1.27; 3 0,-1.27; 4 0,1.27; 5 2.54,-1.27; 6 2.54,1.27
DB9 = drill 1.016 pad 1.88 square: 1 -5.54,-1.42 | drill 1.016 pad 1.88: 2 -2.77,-1.42; 3 0,-1.42; 4 2.77,-1.42; 5 5.54,-1.42; 6 -4.15,1.42; 7 -1.38,1.42; 8 1.38,1.42; 9 4.15,1.42 | drill 3.302 pad 5.08: G1 -12.5,0; G2 12.5,0
LED5MM' = drill 0.813 octagon: A -1.27,0; K 1.27,0
0207/10 = drill 0.813 octagon: 1 -5.08,0; 2 5.08,0
RN-7 = drill 0.813 long: 1 -7.62,0; 2 -5.08,0; 3 -2.54,0; 4 0,0; 5 2.54,0; 6 5.08,0; 7 7.62,0
TRIM-3386 = drill 0.9 pad 1.778: 1 -2.54,-2.857; 2 0,-2.857; 3 2.54,-2.857
FABC96R = drill 1.016 octagon: A1 -2.54,39.37; A2 -2.54,36.83; A3 -2.54,34.29; A4 -2.54,31.75; A5 -2.54,29.21; A6 -2.54,26.67; A7 -2.54,24.13; A8 -2.54,21.59; A9 -2.54,19.05; A10 -2.54,16.51; A11 -2.54,13.97; A12 -2.54,11.43; A13 -2.54,8.89; A14 -2.54,6.35; A15 -2.54,3.81; A16 -2.54,1.27; A17 -2.54,-1.27; A18 -2.54,-3.81; A19 -2.54,-6.35; A20 -2.54,-8.89; A21 -2.54,-11.43; A22 -2.54,-13.97; A23 -2.54,-16.51; A24 -2.54,-19.05; A25 -2.54,-21.59; A26 -2.54,-24.13; A27 -2.54,-26.67; A28 -2.54,-29.21; A29 -2.54,-31.75; A30 -2.54,-34.29; A31 -2.54,-36.83; A32 -2.54,-39.37; B1 -5.08,39.37; B2 -5.08,36.83; B3 -5.08,34.29; B4 -5.08,31.75; B5 -5.08,29.21; B6 -5.08,26.67; B7 -5.08,24.13; B8 -5.08,21.59; B9 -5.08,19.05; B10 -5.08,16.51; B11 -5.08,13.97; B12 -5.08,11.43; B13 -5.08,8.89; B14 -5.08,6.35; B15 -5.08,3.81; B16 -5.08,1.27; B17 -5.08,-1.27; B18 -5.08,-3.81; B19 -5.08,-6.35; B20 -5.08,-8.89; B21 -5.08,-11.43; B22 -5.08,-13.97; B23 -5.08,-16.51; B24 -5.08,-19.05; B25 -5.08,-21.59; B26 -5.08,-24.13; B27 -5.08,-26.67; B28 -5.08,-29.21; B29 -5.08,-31.75; B30 -5.08,-34.29; B31 -5.08,-36.83; B32 -5.08,-39.37; C1 -7.62,39.37; C2 -7.62,36.83; C3 -7.62,34.29; C4 -7.62,31.75; C5 -7.62,29.21; C6 -7.62,26.67; C7 -7.62,24.13; C8 -7.62,21.59; C9 -7.62,19.05; C10 -7.62,16.51; C11 -7.62,13.97; C12 -7.62,11.43; C13 -7.62,8.89; C14 -7.62,6.35; C15 -7.62,3.81; C16 -7.62,1.27; C17 -7.62,-1.27; C18 -7.62,-3.81; C19 -7.62,-6.35; C20 -7.62,-8.89; C21 -7.62,-11.43; C22 -7.62,-13.97; C23 -7.62,-16.51; C24 -7.62,-19.05; C25 -7.62,-21.59; C26 -7.62,-24.13; C27 -7.62,-26.67; C28 -7.62,-29.21; C29 -7.62,-31.75; C30 -7.62,-34.29; C31 -7.62,-36.83; C32 -7.62,-39.37 | hole 2.794: 0,-44.456; 0,44.456
LCD1602 = drill 0.8 long: 1 8,33.46; 2 10.54,33.46; 3 13.08,33.46; 4 15.62,33.46; 5 18.16,33.46; 6 20.7,33.46; 7 23.24,33.46; 8 25.78,33.46; 9 28.32,33.46; 10 30.86,33.46; 11 33.4,33.46; 12 35.94,33.46; 13 38.48,33.46; 14 41.02,33.46; 15 43.56,33.46; 16 46.1,33.46 | hole 2.8: 2.54,2.54; 2.54,33.46; 77.46,33.46; 77.46,2.54
ECS-2100AX-200 = drill 0.7 square: 1 -3.81,-3.81 | drill 0.7: 4 3.81,-3.81; 5 3.81,3.81; 8 -3.81,3.81

### Placement (x,y rotation side)
0  168.91,54.61 0 top
1  168.91,62.23 0 top
2  168.91,69.85 0 top
3  168.91,77.47 0 top
4  168.91,86.36 0 top
5  168.91,93.98 0 top
6  168.91,101.6 0 top
7  168.91,109.22 0 top
C1  86.36,67.31 0 top
C2  86.36,60.96 0 top
C3  86.36,54.61 0 top
C4  86.36,73.66 0 top
C5  152.4,41.91 90 top
C6  152.4,30.48 90 top
C7  85.09,81.28 90 top
C8  60.96,62.23 90 top
C9  38.1,48.26 90 top
C10  63.5,48.26 90 top
C11  63.5,34.29 90 top
C12  41.91,34.29 90 top
C13  34.29,20.32 90 top
C14  30.48,62.23 90 top
C15  55.88,99.06 90 top
C16  20.32,99.06 90 top
C17  16.51,48.26 90 top
DATA-ADDR  77.47,5.08 180 top
HI  165.1,41.91 270 top
IC1  57.15,81.28 0 top
IC2  72.39,62.23 0 top
IC3  34.29,99.06 0 top
IC4  44.45,62.23 0 top
IC5  49.53,48.26 0 top
IC6  52.07,34.29 0 top
IC7  73.66,34.29 0 top
IC8  73.66,48.26 0 top
IC9  48.26,20.32 0 top
IC10  69.85,99.06 0 top
IC11  26.67,48.26 0 top
IN  102.87,17.14 90 top
INPUT  102.87,6.35 90 top
INT  27.94,11.43 0 top
IO-ADDR  12.7,5.08 180 top
IO-ADDR-HL  17.78,11.43 0 top
J1  132.08,10.16 180 top
JP1  132.08,20.32 0 top
LO  165.1,30.48 270 top
OUT  168.91,17.78 0 top
PWR  [LED5MM']  173.99,3.81 180 top
R1  158.75,17.78 180 top
R2  160.02,3.81 180 top
R3  158.75,54.61 180 top
R4  158.75,62.23 180 top
R5  158.75,69.85 180 top
R6  158.75,77.47 180 top
R7  158.75,86.36 180 top
R8  158.75,93.98 180 top
R9  158.75,101.6 180 top
R10  158.75,109.22 180 top
RN2  48.26,8.89 0 top
S0  102.87,35.56 90 top
S1  102.87,45.72 90 top
S2  102.87,55.88 90 top
S3  102.87,66.04 90 top
S4  102.87,76.2 90 top
S5  102.87,86.36 90 top
S6  102.87,96.52 90 top
S7  102.87,106.68 90 top
TM1  73.66,20.32 270 top
X1  2.54,57.15 180 top
X2  114.3,110.49 270 top
Y1  21.59,81.28 0 top

### Tracks (layer width: path | path; a pad name or v marks a point on that pad's centre or on a via)
-B-RESET  (via drill 0.25)
  Top 0.152: IC4.1 33.02,24.77 36.83,20.95 IC9.1 | IC10.1 57.15,93.98 v57.15,55.88
  Bottom 0.152: RN2.4 43.81,13.34 40.01,13.34 IC9.1 | IC4.1 35.56,55.88 v57.15,55.88 86.36,55.88 86.36,53.98 85.72,53.34 82.55,53.34 IC8.8
-INT  (via drill 0.25)
  Top 0.152: v71.12,48.9 IC8.12
  Bottom 0.152: RN2.2 41.27,6.99 24.13,6.99 22.23,8.89 12.7,8.89 5.08,16.51 4.45,16.51 3.81,17.14 3.81,46.99 8.89,46.99 X1.C13 38.73,48.26 39.37,48.9 60.96,48.9 61.59,48.26 70.48,48.26 v71.12,48.9
-IO-ADDRSEL
  Top 0.152: IO-ADDR.5 IO-ADDR.7 | IO-ADDR.15 IO-ADDR.13 IO-ADDR.11 IO-ADDR.9 | IO-ADDR.3 IO-ADDR.1 21.59,5.71 57.78,5.71 67.31,15.24 67.31,36.83 IC7.13
  Bottom 0.152: IO-ADDR.9 IO-ADDR.7 | IC7.12 IC7.13 | IO-ADDR.3 IO-ADDR.5
-IO-DATASEL  (via drill 0.25)
  Top 0.152: DATA-ADDR.13 DATA-ADDR.15 | DATA-ADDR.11 DATA-ADDR.9 DATA-ADDR.7 | IC8.11 74.3,51.44 v74.3,48.9 | v83.19,48.26 83.82,47.62 DATA-ADDR.3 DATA-ADDR.5
  Bottom 0.152: DATA-ADDR.11 DATA-ADDR.13 | v74.3,48.9 74.93,48.26 v83.19,48.26 | DATA-ADDR.3 DATA-ADDR.1 | DATA-ADDR.5 DATA-ADDR.7
-IO-RD  (via drill 0.25)
  Top 0.152: v40.01,47.62 39.37,48.26 v39.37,55.24
  Bottom 0.152: IC8.1 65.41,45.09 60.33,45.09 57.78,47.62 v40.01,47.62 | v39.37,55.24 15.24,55.24 10.79,59.69 4.45,59.69 3.17,60.96 3.17,77.47 6.35,77.47 X1.B25
-IO-SEL0  (via drill 0.25)
  Top 0.152: v40.64,54.61 IC5.15 | v6.99,54.61 6.35,53.98 6.35,10.79 2.54,6.99 2.54,5.08 IO-ADDR.16
  Bottom 0.152: v6.99,54.61 v40.64,54.61 | DATA-ADDR.16 67.31,2.54 5.08,2.54 IO-ADDR.16
-IO-SEL1
  Bottom 0.152: IC5.14 43.81,50.16 39.37,50.16 38.73,50.8 35.56,50.8 34.92,50.16 17.78,50.16 17.14,50.8 12.06,50.8 10.79,49.53 4.45,49.53 3.17,48.26 3.17,16.51 3.81,15.88 4.45,15.88 7.62,12.7 7.62,5.08 | 7.62,5.08 7.62,3.81 IO-ADDR.14 | DATA-ADDR.14 69.22,1.91 3.81,1.91 2.54,3.17 2.54,5.08 7.62,5.08
-IO-SEL2  (via drill 0.25)
  Top 0.152: IC5.13 48.9,51.44 v48.9,48.26 | v71.12,46.99 72.39,45.72 72.39,5.08 | DATA-ADDR.12 72.39,5.08 | IO-ADDR.12 12.06,0.64 77.47,0.64 77.47,4.45 76.83,5.08 72.39,5.08
  Bottom 0.152: v48.9,48.26 60.33,48.26 62.87,45.72 64.77,45.72 66.04,46.99 v71.12,46.99
-IO-SEL3  (via drill 0.25)
  Top 0.152: v13.34,53.98 13.34,7.62 12.7,6.99 12.7,5.08 IO-ADDR.10 11.43,2.54 17.14,2.54 17.78,3.17 17.78,4.45 18.41,5.08 22.23,5.08 22.86,4.45 22.86,2.54 74.93,2.54 DATA-ADDR.10
  Bottom 0.152: IC5.12 48.9,53.98 v13.34,53.98
-IO-SEL4  (via drill 0.25)
  Top 0.152: IC5.11 54.61,50.8 v54.61,43.18 | v24.77,42.55 22.23,40.01 22.23,10.16 19.68,7.62 17.78,7.62 17.78,5.71 17.14,5.08 13.97,5.08 IO-ADDR.8
  Bottom 0.152: v54.61,43.18 53.98,42.55 v24.77,42.55 | DATA-ADDR.8 80.01,2.54 81.92,2.54 82.55,3.17 82.55,7.62 65.41,7.62 64.14,6.35 23.5,6.35 22.23,7.62 15.88,7.62 15.24,6.99 15.24,3.81 IO-ADDR.8
-IO-SEL5  (via drill 0.25)
  Top 0.152: v79.38,53.98 80.01,53.34 80.01,48.26 82.55,45.72 82.55,9.53 80.01,6.99 80.01,5.08 DATA-ADDR.6
  Bottom 0.152: IC5.10 57.78,53.98 v79.38,53.98 | IO-ADDR.6 17.78,5.08 80.01,5.08 DATA-ADDR.6
-IO-SEL6  (via drill 0.25)
  Top 0.152: v83.19,49.53 84.45,48.26 84.45,7.62 85.09,6.99 85.09,5.08 DATA-ADDR.4 | IO-ADDR.4 20.95,1.91 v20.95,1.27
  Bottom 0.152: IC5.9 59.69,50.8 64.77,50.8 66.04,49.53 v83.19,49.53 | v20.95,1.27 21.59,0.64 85.09,0.64 87.63,3.17 87.63,5.08 85.09,5.08 DATA-ADDR.4
-IO-SEL7  (via drill 0.25)
  Top 0.152: IC5.7 55.24,43.81 v55.24,41.27 | v85.09,41.27 85.72,40.64 85.72,8.89 87.63,6.99 87.63,5.08 DATA-ADDR.2 | IO-ADDR.2 22.23,3.17 v22.23,1.27
  Bottom 0.152: v85.09,41.27 v55.24,41.27 | v22.23,1.27 83.82,1.27 DATA-ADDR.2
-IO-WR  (via drill 0.25)
  Top 0.152: IC8.3 70.48,45.09 70.48,50.16 69.85,50.8 v69.85,69.22 | v12.7,70.48 10.79,72.39 8.89,72.39 8.89,80.01 X1.B26
  Bottom 0.152: v69.85,69.22 38.73,69.22 37.47,70.48 v12.7,70.48
-RESET  (via drill 0.25)
  Top 0.152: v87,46.35 90.17,49.53 v90.17,81.28
  Bottom 0.152: IC8.5 78.11,46.35 v87,46.35 | v90.17,81.28 87,84.45 26.04,84.45 24.77,83.19 18.41,83.19 X1.C30
DATA0  (via drill 0.25)
  Top 0.152: v101.6,92.08 v104.14,89.53 | IC10.3 v63.5,92.08 | IC9.3 41.91,7.62 41.27,6.99 38.1,6.99 38.1,43.81 35.56,46.35 35.56,55.88 | 35.56,55.88 34.29,57.15 34.29,72.39 IC1.1 33.02,78.74 29.21,82.55 v29.21,92.71 29.21,101.6 IC3.18 | 35.56,55.88 v36.2,56.52
  Bottom 0.152: v104.14,89.53 145.41,89.53 147.32,87.63 X2.7 | v63.5,92.08 v101.6,92.08 | v36.2,56.52 IC4.3 36.2,60.33 32.38,60.33 31.75,59.69 22.86,59.69 20.32,62.23 6.35,62.23 X1.A19 | IC10.3 60.96,92.71 v29.21,92.71
DATA1  (via drill 0.25)
  Top 0.152: IC9.4 43.18,17.78 v43.18,26.67 | v4.45,34.29 3.81,34.92 3.81,64.77 X1.A20 | IC4.4 39.37,59.69 39.37,67.94 | 39.37,67.94 39.37,70.48 v38.1,71.75 | v113.67,88.9 112.39,90.17 v112.39,92.08 | v66.67,92.71 66.04,93.34 IC10.4 | IC3.16 33.66,103.5 33.66,104.78 36.2,107.31 51.44,107.31 v51.44,92.08 | IC1.2 33.66,75.56 33.66,84.45 31.11,87 v31.11,89.53 | 39.37,67.94 v36.2,67.94
  Bottom 0.152: v43.18,26.67 40.01,29.84 15.24,29.84 10.79,34.29 v4.45,34.29 | v38.1,71.75 37.47,71.75 IC1.2 | v113.67,88.9 143.51,88.9 147.32,85.09 X2.8 | v112.39,92.08 111.76,92.71 v66.67,92.71 62.87,92.71 62.23,92.08 v51.44,92.08 33.66,92.08 v31.11,89.53 | X1.A20 6.35,67.31 31.75,67.31 32.38,67.94 v36.2,67.94
DATA2  (via drill 0.25)
  Top 0.152: v97.16,83.19 93.98,86.36 v93.98,93.98 | 46.99,59.69 IC4.7 | v46.99,71.12 46.99,59.69 | IC9.7 51.44,17.14 v51.44,19.05 | v50.16,19.68 48.26,21.59 48.26,40.64 46.99,41.91 46.99,59.69 | v34.92,69.85 38.1,73.03 IC1.3 34.29,77.47 34.29,85.09 31.75,87.63 31.75,99.06 34.29,101.6 34.29,104.14 34.92,104.78 38.1,104.78 IC3.14 v42.55,98.42
  Bottom 0.152: v97.16,83.19 146.69,83.19 147.32,82.55 X2.9 | v93.98,93.98 90.81,97.16 75.56,97.16 IC10.7 71.75,97.16 57.15,97.16 56.52,96.52 46.99,96.52 45.09,98.42 v42.55,98.42 | v46.99,71.12 46.35,71.75 40.01,71.75 IC1.3 | v51.44,19.05 50.8,19.68 v50.16,19.68 | X1.A21 6.35,69.85 v34.92,69.85
DATA3  (via drill 0.25)
  Top 0.152: v79.38,78.74 77.47,80.64 77.47,93.98 IC10.8 | IC1.4 41.27,73.03 v41.27,71.12 41.27,67.94 41.91,67.31 v41.91,60.33 | IC3.12 46.99,106.68 49.53,106.68 v49.53,78.74 49.53,59.69 IC4.8 | IC9.8 55.24,17.14 55.24,19.68 58.42,22.86 58.42,34.29 60.96,36.83 v60.96,59.69
  Bottom 0.152: X2.10 147.32,80.01 87,80.01 85.72,78.74 v79.38,78.74 v49.53,78.74 | 48.9,60.33 v41.91,60.33 | IC4.8 48.9,60.33 | v60.96,59.69 57.15,59.69 56.52,60.33 48.9,60.33 | X1.A22 6.35,72.39 31.75,72.39 33.02,71.12 v41.27,71.12
DATA4  (via drill 0.25)
  Top 0.152: v111.12,77.47 111.12,107.31 107.31,111.12 76.2,111.12 76.2,104.78 | IC10.13 76.2,104.78 | IC3.9 44.45,93.98 44.45,87.63 43.81,87 43.81,74.3 IC1.5 43.18,71.12 v43.81,70.48 | IC4.13 50.16,66.67 v50.16,69.85 | IC9.13 55.88,25.4 55.88,41.91 57.15,43.18 57.15,53.34 59.05,55.24 59.05,58.42 57.78,59.69 v57.78,70.48 | 76.2,104.78 64.77,104.78 64.77,101.6 59.69,96.52 v59.69,93.98
  Bottom 0.152: v111.12,77.47 147.32,77.47 X2.11 | 49.53,70.48 v50.16,69.85 | v43.81,70.48 49.53,70.48 | 49.53,70.48 v57.78,70.48 | X1.A23 6.35,74.93 31.75,74.93 32.38,75.56 41.27,75.56 IC1.5 | v59.69,93.98 59.05,93.34 45.09,93.34 IC3.9
DATA5  (via drill 0.25)
  Top 0.152: 46.99,72.39 48.26,71.12 IC4.14 | 46.99,72.39 IC1.6 | IC3.7 40.01,97.16 46.99,97.16 | 46.99,72.39 46.99,97.16 | 95.89,74.3 93.34,76.83 v93.34,101.6 | 95.89,74.3 v97.79,72.39 | v86.36,24.13 95.89,33.66 95.89,74.3 | 46.99,97.16 48.9,99.06 v48.9,106.05
  Bottom 0.152: X1.A24 3.81,74.93 3.81,64.77 31.75,64.77 32.38,64.14 43.81,64.14 44.45,64.77 44.45,67.94 46.35,67.94 IC4.14 | v97.79,72.39 145.41,72.39 147.32,74.3 X2.12 | v93.34,101.6 90.17,104.78 75.56,104.78 74.3,103.5 | IC10.14 74.3,103.5 | IC9.14 54.61,21.59 67.31,21.59 69.85,24.13 v86.36,24.13 | v48.9,106.05 71.75,106.05 74.3,103.5
DATA6  (via drill 0.25)
  Top 0.152: v4.45,29.21 3.17,30.48 3.17,76.83 X1.A25 | IC4.17 40.01,66.67 40.01,71.75 39.37,72.39 39.37,76.2 | 39.37,76.2 39.37,85.09 36.83,87.63 36.83,91.44 IC3.5 | v41.27,76.2 39.37,76.2
  Bottom 0.152: IC9.17 39.37,29.21 v4.45,29.21 | IC10.17 62.23,99.06 36.83,99.06 IC3.5 | X2.13 147.32,71.75 50.16,71.75 IC1.7 45.72,76.2 v41.27,76.2 32.38,76.2 28.57,80.01 6.35,80.01 X1.A25
DATA7  (via drill 0.25)
  Top 0.152: v50.8,68.58 51.44,69.22 v51.44,71.12 50.8,71.75 IC1.8 50.8,76.83 52.07,78.11 52.07,104.78 59.05,104.78 59.69,104.14 59.69,100.97 61.59,100.97 IC10.18 | v38.73,27.3 38.73,44.45 36.83,46.35 36.83,64.77 IC4.18
  Bottom 0.152: X1.A26 6.35,81.28 6.35,92.08 6.99,92.71 25.4,92.71 IC3.3 32.38,99.69 45.09,99.69 46.99,101.6 56.52,101.6 57.15,100.97 61.59,100.97 IC10.18 | v51.44,71.12 146.05,71.12 147.32,69.85 X2.14 | IC4.18 40.64,68.58 v50.8,68.58 | v38.73,27.3 IC9.18
GND  (via drill 0.25)
  Top 0.152: IC7.7 78.74,33.02 IC7.9 78.74,41.91 IC8.7 | IC9.10 60.96,17.78 60.96,29.21 IC6.7 | C15.2 54.61,99.06 54.61,97.79 v52.7,95.89 54.61,93.98 54.61,57.15 | 54.61,57.15 52.07,54.61 52.07,45.72 IC5.5 | 54.61,57.15 IC4.10 | X1.A32 X1.B32 8.89,96.52 | X1.C32 8.89,96.52 | 8.89,96.52 8.89,83.19 9.53,82.55 16.51,82.55 C17.2 | IC1.14 IC2.15 66.04,64.77 64.77,63.5 64.77,57.15 64.14,56.52 64.14,50.16 C10.2 | Y1.4 30.48,72.39 C14.2 29.21,62.23 IC11.10 | X1.B1 X1.C1 | IC11.10 IC11.11 | IC11.10 IC11.9 | C13.2 29.21,26.67 IC11.5 IC11.10 | PWR.K 170.18,6.35 170.18,16.51 | OUT.K 170.18,16.51 | LO.7 LO.8 157.48,16.51 170.18,16.51 | LO.7 HI.8 HI.7 HI.5 170.18,53.34 0.K 1.K 2.K 3.K 4.K 5.K 6.K 7.K | LO.7 LO.5 | v83.82,87 85.09,85.72 C7.2 83.82,81.28 83.82,74.93 C4.+ | IC10.10 82.55,93.98 82.55,74.93 IC1.20 | 107.95,17.14 116.84,17.14 121.92,12.06 126.36,12.06 J1.5 | 107.95,96.52 107.95,106.68 S7.3 | 107.95,86.36 107.95,76.2 | 107.95,45.72 107.95,35.56 | 107.95,66.04 107.95,55.88 | 107.95,55.88 107.95,45.72 | 107.95,45.72 S1.3 | 107.95,55.88 S2.3 | 107.95,66.04 107.95,76.2 | 107.95,76.2 S4.3 | 107.95,66.04 S3.3 | 107.95,86.36 107.95,96.52 | 107.95,96.52 S6.3 | 107.95,86.36 S5.3 | 107.95,35.56 107.95,17.14 | 107.95,17.14 IN.3 | 107.95,35.56 S0.3
  Bottom 0.152: IC7.9 IC7.10 73.66,35.56 C11.2 59.69,35.56 | IC9.10 60.96,17.78 TM1.3 | 59.69,35.56 IC6.7 | 59.69,35.56 C12.2 | IC3.10 46.35,95.89 v52.7,95.89 | IC8.7 79.38,42.55 60.33,42.55 IC5.8 56.52,46.35 52.7,46.35 IC5.5 48.9,46.35 39.37,46.35 37.47,44.45 IC11.7 32.38,46.35 31.11,46.35 IC11.5 IC11.4 IC11.3 | C16.2 16.51,96.52 X1.C32 | C17.2 C9.2 C10.2 | IC2.15 63.5,63.5 C8.2 C14.2 | X1.A1 X1.B1 IO-ADDR-HL.1 | X1.C1 8.89,19.05 8.89,21.59 C13.2 | C5.2 154.94,45.72 HI.7 | C6.2 154.94,34.29 LO.7 | 152.4,100.33 149.86,100.33 147.96,102.23 X2.1 147.32,102.87 144.15,106.05 108.58,106.05 107.95,106.68 S7.3 | 152.4,100.33 154.94,100.33 154.94,93.34 154.31,92.71 147.96,92.71 X2.5 | 152.4,100.33 152.4,102.87 168.91,102.87 6.K | IC1.25 73.03,87 v83.82,87 | C4.+ IC1.20 | S3.3 146.05,66.04 147.32,64.77 X2.16 | IC10.10 83.19,93.34 104.14,93.34 107.31,96.52 S6.3 | IC7.7 83.19,32.38 104.14,32.38 107.31,35.56 S0.3
ICLK
  Bottom 0.152: IC1.9 55.24,75.56 66.67,75.56 IC1.15
IN  (via drill 0.25)
  Top 0.152: X1.C26 13.34,78.11 13.34,55.24 12.7,54.61 v12.7,19.68
  Bottom 0.152: v12.7,19.68 18.41,13.97 38.1,13.97 41.27,10.79 43.81,10.79 44.45,10.16 44.45,6.99 63.5,6.99 64.77,8.26 99.69,8.26 INPUT.1
IO-ADDR0  (via drill 0.25)
  Top 0.152: IC5.1 40.01,43.81 v40.01,40.01 | v12.06,37.47 11.43,36.83 11.43,34.29 X1.C7
  Bottom 0.152: v40.01,40.01 37.47,37.47 v12.06,37.47
IO-ADDR1  (via drill 0.25)
  Top 0.152: v43.18,30.48 IC5.2
  Bottom 0.152: v43.18,30.48 15.88,30.48 10.79,35.56 X1.C8
IO-ADDR2  (via drill 0.25)
  Top 0.152: IC5.3 45.09,43.81 v45.09,41.91
  Bottom 0.152: v45.09,41.91 24.13,41.91 22.86,43.18 22.86,46.35 18.41,46.35 15.24,43.18 15.24,38.73 10.79,38.73 X1.C9
IO-ADDR3  (via drill 0.25)
  Top 0.152: v14.61,39.37 15.24,38.73 IO-ADDR-HL.2
  Bottom 0.152: IO-ADDR-HL.2 16.51,11.43 19.05,11.43 IO-ADDR-HL.5 | X1.C10 11.43,39.37 v14.61,39.37
IO-RD  (via drill 0.25)
  Top 0.152: RN2.7 59.69,8.89 64.77,13.97 v64.77,27.3 64.77,40.64 IC8.2 | v52.7,27.3 IC6.3 | IC1.22 80.01,87.63 80.01,69.85 82.55,67.31 v82.55,46.99
  Bottom 0.152: v64.77,27.3 v52.7,27.3 | v82.55,46.99 73.03,46.99 72.39,46.35 70.48,46.35 IC8.2
IO-SELDATA  (via drill 0.25)
  Top 0.152: RN2.3 45.72,29.21 IC6.2 | 57.15,40.01 v56.52,40.64 | IC6.9 57.15,40.01 | IC8.10 75.56,51.44 75.56,46.35 74.93,45.72 v74.93,41.91 | IC1.12 59.05,71.75 59.05,59.69 59.69,59.05 59.69,42.55 57.15,40.01 | IC6.4 50.8,31.75 v50.8,40.64
  Bottom 0.152: IC6.4 50.16,32.38 48.9,32.38 IC6.2 | IC11.2 21.59,40.64 v50.8,40.64 53.34,40.64 | v56.52,40.64 53.34,40.64 | v74.93,41.91 54.61,41.91 53.34,40.64
IO-WR  (via drill 0.25)
  Top 0.152: IC6.11 52.7,37.47 52.7,32.38 53.34,31.75 v53.34,28.57 RN2.6 | IC7.5 74.93,31.75 74.93,39.37 74.3,40.01 74.3,43.81 IC8.4 73.66,45.72 74.93,46.99 74.93,53.34 77.47,55.88 77.47,59.69 80.01,62.23 80.01,67.31 79.38,67.94 79.38,73.03 IC1.19
  Bottom 0.152: IC7.5 74.3,28.57 v53.34,28.57 46.35,28.57 IC6.1 43.81,31.11 22.86,31.11 17.78,36.2 11.43,36.2 11.43,38.1 19.05,38.1 IC11.1
LCD-ENABLE  (via drill 0.25)
  Top 0.152: IC6.10 53.98,37.47 v53.98,34.92 | v18.41,36.83 17.78,37.47 17.78,75.56 19.68,77.47 v19.68,83.82 | v67.31,85.72 67.31,93.98 IC10.5
  Bottom 0.152: v53.98,34.92 53.34,34.29 20.95,34.29 v18.41,36.83 | v19.68,83.82 22.23,86.36 41.91,86.36 42.55,85.72 v67.31,85.72
LCD-REGISTER  (via drill 0.25)
  Top 0.152: v74.3,99.69 71.12,96.52 IC10.6
  Bottom 0.152: v74.3,99.69 108.58,99.69 111.76,96.52 146.05,96.52 147.32,95.25 X2.4
N$1  (via drill 0.25)
  Top 0.152: v78.74,107.95 92.71,93.98 v92.71,38.73
  Bottom 0.152: IC3.2 31.75,101.6 31.75,107.95 v78.74,107.95 | v92.71,38.73 99.69,38.73 S0.2
N$2  (via drill 0.25)
  Top 0.152: IC3.4 29.84,95.89 v29.84,100.97 | v102.87,110.49 105.41,107.95 105.41,48.26 S1.2
  Bottom 0.152: v29.84,100.97 29.21,101.6 29.21,110.49 v102.87,110.49
N$3  (via drill 0.25)
  Top 0.152: IC3.6 36.83,96.52 v36.83,104.14 | v102.23,100.97 104.78,98.42 104.78,57.78 S2.2
  Bottom 0.152: v36.83,104.14 38.1,105.41 71.12,105.41 72.39,104.14 72.39,100.97 v102.23,100.97
N$4  (via drill 0.25)
  Top 0.152: IC3.8 41.91,93.98 v41.91,87.63 | v99.06,90.81 100.33,89.53 100.33,68.58 S3.2
  Bottom 0.152: v41.91,87.63 43.18,86.36 92.71,86.36 97.16,90.81 v99.06,90.81
N$5  (via drill 0.25)
  Top 0.152: v99.06,100.33 100.33,99.06 100.33,90.81 100.97,90.17 100.97,78.11 S4.2
  Bottom 0.152: IC3.11 47.62,104.78 69.22,104.78 69.85,104.14 69.85,100.33 v99.06,100.33
N$6  (via drill 0.25)
  Top 0.152: v93.98,107.31 96.52,109.86 100.33,109.86 100.33,100.33 100.97,99.69 100.97,91.44 102.87,89.53 S5.2
  Bottom 0.152: IC3.13 38.73,100.97 34.92,100.97 34.29,101.6 34.29,106.68 34.92,107.31 v93.98,107.31
N$7  (via drill 0.25)
  Top 0.152: v100.97,101.6 101.6,100.97 101.6,97.79 S6.2
  Bottom 0.152: IC3.15 35.56,106.68 91.44,106.68 96.52,101.6 v100.97,101.6
N$8
  Bottom 0.152: IC3.17 30.48,109.86 99.69,109.86 S7.2
N$9
  Top 0.152: OUT.A R1.1
N$10
  Top 0.152: 2.A R5.1
N$11
  Bottom 0.152: R2.1 166.37,2.54 173.99,2.54 PWR.A
N$12
  Top 0.152: 3.A R6.1
N$13
  Top 0.152: 4.A R7.1
N$14
  Top 0.152: 0.A R3.1
N$15
  Top 0.152: 1.A R4.1
N$16
  Top 0.152: 5.A R8.1
N$17
  Top 0.152: 7.A R10.1
N$18
  Top 0.152: 6.A R9.1
N$19  (via drill 0.25)
  Top 0.152: v20.95,69.22 20.95,96.52 21.59,97.16 21.59,104.14 29.84,112.39 153.67,112.39 R10.2
  Bottom 0.152: IC4.19 37.47,67.94 37.47,69.22 v20.95,69.22
N$20  (via drill 0.25)
  Top 0.152: IC4.16 42.55,66.67 42.55,71.75 41.91,72.39 v41.91,85.09
  Bottom 0.152: v41.91,85.09 92.71,85.09 97.79,90.17 146.05,90.17 146.69,90.81 153.67,90.81 155.57,92.71 155.57,101.6 R9.2
N$21  (via drill 0.25)
  Top 0.152: v87,68.58 89.53,71.12 v89.53,87
  Bottom 0.152: IC4.15 47.62,64.14 59.05,64.14 62.87,67.94 83.82,67.94 84.45,68.58 v87,68.58 | v89.53,87 93.98,91.44 144.78,91.44 146.69,93.34 153.03,93.34 R8.2
N$22
  Bottom 0.152: IC4.12 55.88,68.58 83.19,68.58 83.82,69.22 146.05,69.22 147.32,67.94 148.59,67.94 154.94,74.3 154.94,86.36 R7.2
N$23  (via drill 0.25)
  Top 0.152: IC4.9 52.7,59.05 52.7,64.14 52.07,64.77 v52.07,76.83
  Bottom 0.152: v52.07,76.83 93.34,76.83 97.16,73.03 144.15,73.03 146.69,75.56 151.76,75.56 R6.2
N$24  (via drill 0.25)
  Top 0.152: IC4.6 46.35,57.78 v46.35,55.24 | v57.78,55.24 58.42,55.88 v58.42,57.15
  Bottom 0.152: v57.78,55.24 v46.35,55.24 | v58.42,57.15 60.33,59.05 62.23,59.05 62.23,60.96 83.19,60.96 84.45,59.69 145.41,59.69 153.67,67.94 R5.2
N$25  (via drill 0.25)
  Top 0.152: IC4.5 43.81,57.78 v43.81,55.24 | v83.19,55.24 83.82,54.61 v83.82,52.7
  Bottom 0.152: v43.81,55.24 44.45,54.61 65.41,54.61 66.04,55.24 v83.19,55.24 | v83.82,52.7 144.15,52.7 R4.2
N$26  (via drill 0.25)
  Top 0.152: IC4.2 36.2,59.05 v36.2,62.23 | v65.41,62.23 67.31,60.33 v67.31,50.8
  Bottom 0.152: v65.41,62.23 v36.2,62.23 | v67.31,50.8 67.94,50.16 149.22,50.16 R3.2
N$27  (via drill 0.25)
  Top 0.152: v48.26,41.91 IC5.4 | v22.23,41.27 21.59,40.64 21.59,12.06 20.95,11.43 17.78,11.43 IO-ADDR-HL.3
  Bottom 0.152: v48.26,41.91 47.62,41.27 v22.23,41.27
N$28  (via drill 0.25)
  Top 0.152: v165.1,24.13 166.37,25.4 166.37,36.83 HI.12
  Bottom 0.152: IC9.19 43.18,20.32 68.58,20.32 69.85,21.59 127.64,21.59 130.18,24.13 v165.1,24.13
N$29  (via drill 0.25)
  Top 0.152: v53.34,36.83 IC5.6 | v19.68,36.83 17.78,34.92 IO-ADDR-HL.4
  Bottom 0.152: v53.34,36.83 52.7,36.2 43.18,36.2 42.55,36.83 v19.68,36.83
N$30
  Bottom 0.152: IC7.3 73.03,32.38 78.11,32.38 85.09,39.37 153.03,39.37 153.67,40.01 158.75,40.01 158.75,83.82 154.94,87.63 149.86,87.63 147.96,89.53 X2.6
N$31  (via drill 0.25)
  Top 0.152: Y1.5 32.38,78.11 v32.38,77.47
  Bottom 0.152: v32.38,77.47 33.02,76.83 50.8,76.83 51.44,76.2 68.58,76.2 IC1.16
N$32  (via drill 0.25)
  Top 0.152: IC6.6 57.78,31.11 57.78,36.2 58.42,36.83 58.42,40.01 60.33,41.91 60.33,59.69 59.69,60.33 v59.69,61.59 | v21.59,62.23 21.59,93.98 IC3.1 22.86,100.33 IC3.19
  Bottom 0.152: v59.69,61.59 31.75,61.59 31.11,62.23 v21.59,62.23
N$33  (via drill 0.25)
  Top 0.152: v65.41,36.2 66.04,35.56 IC7.1
  Bottom 0.152: IC7.2 IC7.1 | IC6.8 60.96,36.83 64.77,36.83 v65.41,36.2
N$34
  Top 0.152: IN.2 INPUT.2
N$35
  Top 0.152: JP1.4 133.35,20.32 133.35,13.34 134.62,12.06 J1.2
N$36
  Top 0.152: J1.3 JP1.3
N$37
  Top 0.152: IC1.11 60.33,75.56 62.23,75.56 62.23,72.39 62.87,71.75 64.77,71.75 64.77,74.93 65.41,75.56 74.93,75.56 74.93,67.31 IC2.11
N$40  (via drill 0.25)
  Top 0.152: v86.36,38.1 86.36,70.48 83.19,73.66 83.19,100.97 IC10.11
  Bottom 0.152: v86.36,38.1 IC7.6
N$41  (via drill 0.25)
  Top 0.152: IC6.12 49.53,54.61 52.07,57.15 v52.07,62.87 | v55.24,62.87 55.88,63.5 IC4.11
  Bottom 0.152: v55.24,62.87 v52.07,62.87
N$44  (via drill 0.25)
  Top 0.152: v113.03,97.16 111.76,95.89 v111.76,20.95
  Bottom 0.152: v113.03,97.16 147.32,97.16 X2.3 | v111.76,20.95 111.12,20.32 TM1.2
N$51  (via drill 0.25)
  Top 0.152: v87,58.42 87.63,59.05 C2.-
  Bottom 0.152: IC2.5 75.56,60.33 82.55,60.33 84.45,58.42 v87,58.42
N$52  (via drill 0.25)
  Top 0.152: v74.3,61.59 IC2.4
  Bottom 0.152: v74.3,61.59 84.45,61.59 C2.+
N$57  (via drill 0.25)
  Top 0.152: IC1.30 57.78,88.27 v57.78,83.82 | v27.3,81.92 22.86,77.47 22.86,48.26 25.4,45.72 25.4,12.7 INT.1
  Bottom 0.152: v57.78,83.82 55.88,81.92 v27.3,81.92
N$62  (via drill 0.25)
  Top 0.152: IC2.3 69.22,59.05 v69.22,62.87
  Bottom 0.152: v69.22,62.87 70.48,64.14 84.45,64.14 C1.-
N$63  (via drill 0.25)
  Top 0.152: IC2.1 64.14,59.05 64.14,64.14 64.77,64.77 v64.77,70.48 | C1.+ v81.92,70.48
  Bottom 0.152: v81.92,70.48 v64.77,70.48
N$64  (via drill 0.25)
  Top 0.152: IC2.2 66.67,57.78 v66.67,54.61
  Bottom 0.152: C3.+ v66.67,54.61
N$65  (via drill 0.25)
  Top 0.152: IC2.6 76.83,59.05 76.83,64.14 77.47,64.77 v77.47,74.93
  Bottom 0.152: v77.47,74.93 78.11,75.56 85.72,75.56 C4.-
N$66  (via drill 0.25)
  Top 0.152: IC8.13 69.22,51.44 69.22,46.35 69.85,45.72 69.85,24.13 67.94,22.23 v67.94,19.68 | INT.2 v36.2,18.41
  Bottom 0.152: v67.94,19.68 66.67,18.41 v36.2,18.41
N$67
  Top 0.152: IC7.11 IC7.4
N$68  (via drill 0.25)
  Top 0.152: IC9.16 47.62,23.5 47.62,18.41 48.26,17.78 v48.26,13.34
  Bottom 0.152: v48.26,13.34 48.9,12.7 117.47,12.7 120.65,15.88 163.83,15.88 170.81,22.86 172.72,22.86 174.62,24.77 174.62,36.2 172.09,36.2 HI.13
N$69  (via drill 0.25)
  Top 0.152: IC9.15 50.8,22.86 v50.8,13.34 | v166.37,22.86 168.91,25.4 168.91,44.45 HI.2
  Bottom 0.152: v50.8,13.34 116.84,13.34 120.02,16.51 159.38,16.51 165.74,22.86 v166.37,22.86
N$70  (via drill 0.25)
  Top 0.152: v158.12,24.77 163.83,30.48 163.83,41.91 HI.3
  Bottom 0.152: IC9.12 59.05,22.23 66.67,22.23 69.22,24.77 v158.12,24.77
N$71  (via drill 0.25)
  Top 0.152: IC9.9 59.05,14.61 62.87,14.61 v62.87,26.04
  Bottom 0.152: v62.87,26.04 63.5,26.67 154.94,26.67 156.84,28.57 165.74,28.57 LO.12
N$72  (via drill 0.25)
  Top 0.152: v90.81,14.61 102.87,2.54 173.99,2.54 173.99,22.86 LO.13
  Bottom 0.152: IC9.6 51.44,14.61 v90.81,14.61
N$73  (via drill 0.25)
  Top 0.152: v46.99,21.59 IC9.5
  Bottom 0.152: v46.99,21.59 48.26,22.86 48.26,27.94 146.69,27.94 154.94,36.2 168.28,36.2 LO.2
N$74
  Bottom 0.152: IC9.2 41.91,13.97 113.67,13.97 117.47,17.78 151.76,17.78 157.48,23.5 172.09,23.5 173.99,25.4 173.99,32.38 169.54,32.38 LO.3
N$75
  Top 0.152: IC11.12 27.94,48.26 27.94,10.16 31.75,6.35 54.61,6.35 54.61,13.97 55.88,15.24 55.88,19.05 59.69,22.86 IC9.11
OUT  (via drill 0.25)
  Top 0.152: R1.2 153.67,52.7 150.5,55.88 v150.5,76.83
  Bottom 0.152: v150.5,76.83 149.22,78.11 109.86,78.11 108.58,79.38 87.63,79.38 86.36,78.11 31.75,78.11 28.57,81.28 12.7,81.28 X1.C27
RESET  (via drill 0.25)
  Top 0.152: v73.03,12.06 77.47,16.51 77.47,43.18 IC8.6 IC8.9 78.74,55.88 v78.11,56.52 | IC1.35 45.09,88.27 45.09,75.56 44.45,74.93 v44.45,57.15
  Bottom 0.152: RN2.5 53.98,12.06 v73.03,12.06 | v44.45,57.15 45.09,56.52 v78.11,56.52
RX  (via drill 0.25)
  Top 0.152: IC1.10 56.52,73.03 v56.52,69.85 | v70.48,69.85 73.66,66.67 IC2.12
  Bottom 0.152: v70.48,69.85 v56.52,69.85
RX-IN  (via drill 0.25)
  Top 0.152: v74.3,62.87 IC2.13 | v108.58,62.87 111.12,60.33 111.12,20.32 112.39,19.05 JP1.1
  Bottom 0.152: v108.58,62.87 v74.3,62.87 | JP1.6 133.35,20.32 130.81,20.32 JP1.1
SWITCH-LED  (via drill 0.25)
  Top 0.152: v47.62,33.66 46.99,34.29 IC6.13 | IC10.2 62.87,93.34 v62.87,91.44 | v88.27,91.44 90.81,88.9 90.81,30.48 v86.36,26.04 | v55.24,26.67 54.61,27.3 IC6.5
  Bottom 0.152: IC6.5 51.44,33.66 v47.62,33.66 | v88.27,91.44 v62.87,91.44 | v86.36,26.04 85.72,25.4 60.96,25.4 59.69,26.67 v55.24,26.67
TIL311
  Top 0.152: IC11.13 22.23,52.7 22.23,89.53 26.67,93.98 26.67,104.14 30.48,107.95 60.96,107.95 IC10.19
TX-OUT  (via drill 0.25)
  Top 0.152: v112.39,62.23 113.67,60.96 113.67,30.48 122.56,21.59 JP1.2
  Bottom 0.152: IC2.14 68.58,62.23 v112.39,62.23 | JP1.5 135.89,20.32 135.89,22.86 130.81,22.86 JP1.2
UART-A0  (via drill 0.25)
  Top 0.152: IC1.28 64.14,89.53 v64.14,93.34
  Bottom 0.152: v64.14,93.34 76.83,93.34 IC10.9
UART-A1
  Top 0.152: IC1.27 66.67,88.27 66.67,85.09 74.93,85.09 74.93,99.06 IC10.12
UART-A2
  Top 0.152: IC1.26 69.85,90.17 69.85,101.6 IC10.15
UART-CS
  Top 0.152: IC1.13 64.14,74.3 64.14,87 64.77,87.63 64.77,97.79 68.58,101.6 IC10.16
VCC  (via drill 0.25)
  Top 0.152: IC1.39 IC1.40 | IC1.37 IC1.38 | X1.B31 X1.A31 | 20.32,87.63 Y1.8 | C16.1 20.32,93.98 | 20.32,93.98 20.32,87.63 | 20.32,87.63 20.32,53.34 IC11.14 20.32,50.8 IO-ADDR-HL.6 | 20.32,93.98 X1.C31 | IC5.16 44.45,48.26 44.45,46.35 | IC6.14 44.45,46.35 | X1.B2 X1.C2 | 40.64,34.29 39.37,35.56 39.37,45.72 38.73,46.35 | 40.64,34.29 C12.1 | C9.1 38.73,46.35 | 40.64,34.29 v40.64,21.59 RN2.1 | 38.73,46.35 44.45,46.35 | LO.14 LO.1 HI.14 HI.1 | R2.2 152.4,6.35 C6.1 151.13,30.48 151.13,39.37 C5.1 | IC8.14 64.77,50.8 64.77,48.26 C10.1 | C10.1 62.23,45.72 62.23,34.29 C11.1 63.5,21.59 v64.14,20.95 | IC4.20 31.75,64.77 31.75,62.23 C14.1 | IC2.16 62.23,64.77 62.23,62.23 61.59,61.59 | C8.1 61.59,61.59 | C10.1 61.59,48.9 61.59,61.59 | 98.42,35.56 98.42,17.14 IN.1 | 98.42,76.2 98.42,66.04 | 98.42,55.88 98.42,45.72 | 98.42,55.88 98.42,66.04 | 98.42,66.04 S3.1 | 98.42,55.88 S2.1 | 98.42,45.72 98.42,35.56 | 98.42,35.56 S0.1 | 98.42,45.72 S1.1 | IC1.18 76.83,74.3 v76.83,79.38 | IC10.20 57.15,101.6 57.15,99.06 C15.1 | 98.42,96.52 98.42,86.36 | 98.42,96.52 98.42,106.68 S7.1 | 98.42,96.52 S6.1 | 98.42,86.36 98.42,76.2 | 98.42,76.2 S4.1 | 98.42,86.36 S5.1
  Bottom 0.152: IC1.37 IC1.36 45.09,90.81 79.38,90.81 IC1.21 | IC1.38 IC1.39 | X1.B31 X1.C31 | IC3.20 22.86,97.79 C16.1 | IC1.40 31.11,87 19.68,87 Y1.8 | IC6.14 46.35,40.01 64.14,40.01 IC7.14 68.58,40.64 85.72,40.64 92.71,47.62 | X1.B2 X1.A2 | 36.83,20.32 36.83,19.05 C13.1 | 36.83,20.32 36.83,21.59 | 36.83,21.59 IC9.20 | 36.83,20.32 X1.C2 | RN2.1 40.01,9.53 23.5,9.53 IO-ADDR-HL.6 | C9.1 C17.1 | v40.64,21.59 36.83,21.59 | 151.13,42.55 151.13,40.64 C5.1 | 151.13,42.55 151.13,43.81 153.67,46.35 154.94,46.35 154.94,70.48 154.31,71.12 153.03,71.12 149.22,67.31 147.96,67.31 X2.15 | LO.14 170.18,29.21 C6.1 | v64.14,20.95 67.94,20.95 69.22,22.23 69.85,22.23 70.48,22.86 TM1.1 | C8.1 C14.1 | C3.- 88.9,55.88 S2.1 | X2.2 147.32,100.33 144.15,103.5 101.6,103.5 98.42,106.68 S7.1 | v76.83,79.38 77.47,80.01 C7.1 85.72,80.64 92.08,80.64 97.79,86.36 S5.1 | C15.1 96.52,97.79 97.79,96.52 S6.1 | C10.1 64.14,47.62 92.71,47.62 | 92.71,47.62 95.89,47.62 97.79,45.72 S1.1 98.42,45.72 101.6,42.55 151.13,42.55

### Text on the board
tNames: YACC1 IO V1.1 | H | L | 0 | 0 | onepagecomputer.com